# Altium project UAV_Main_Board.PrjPcb (part 1 of 2)
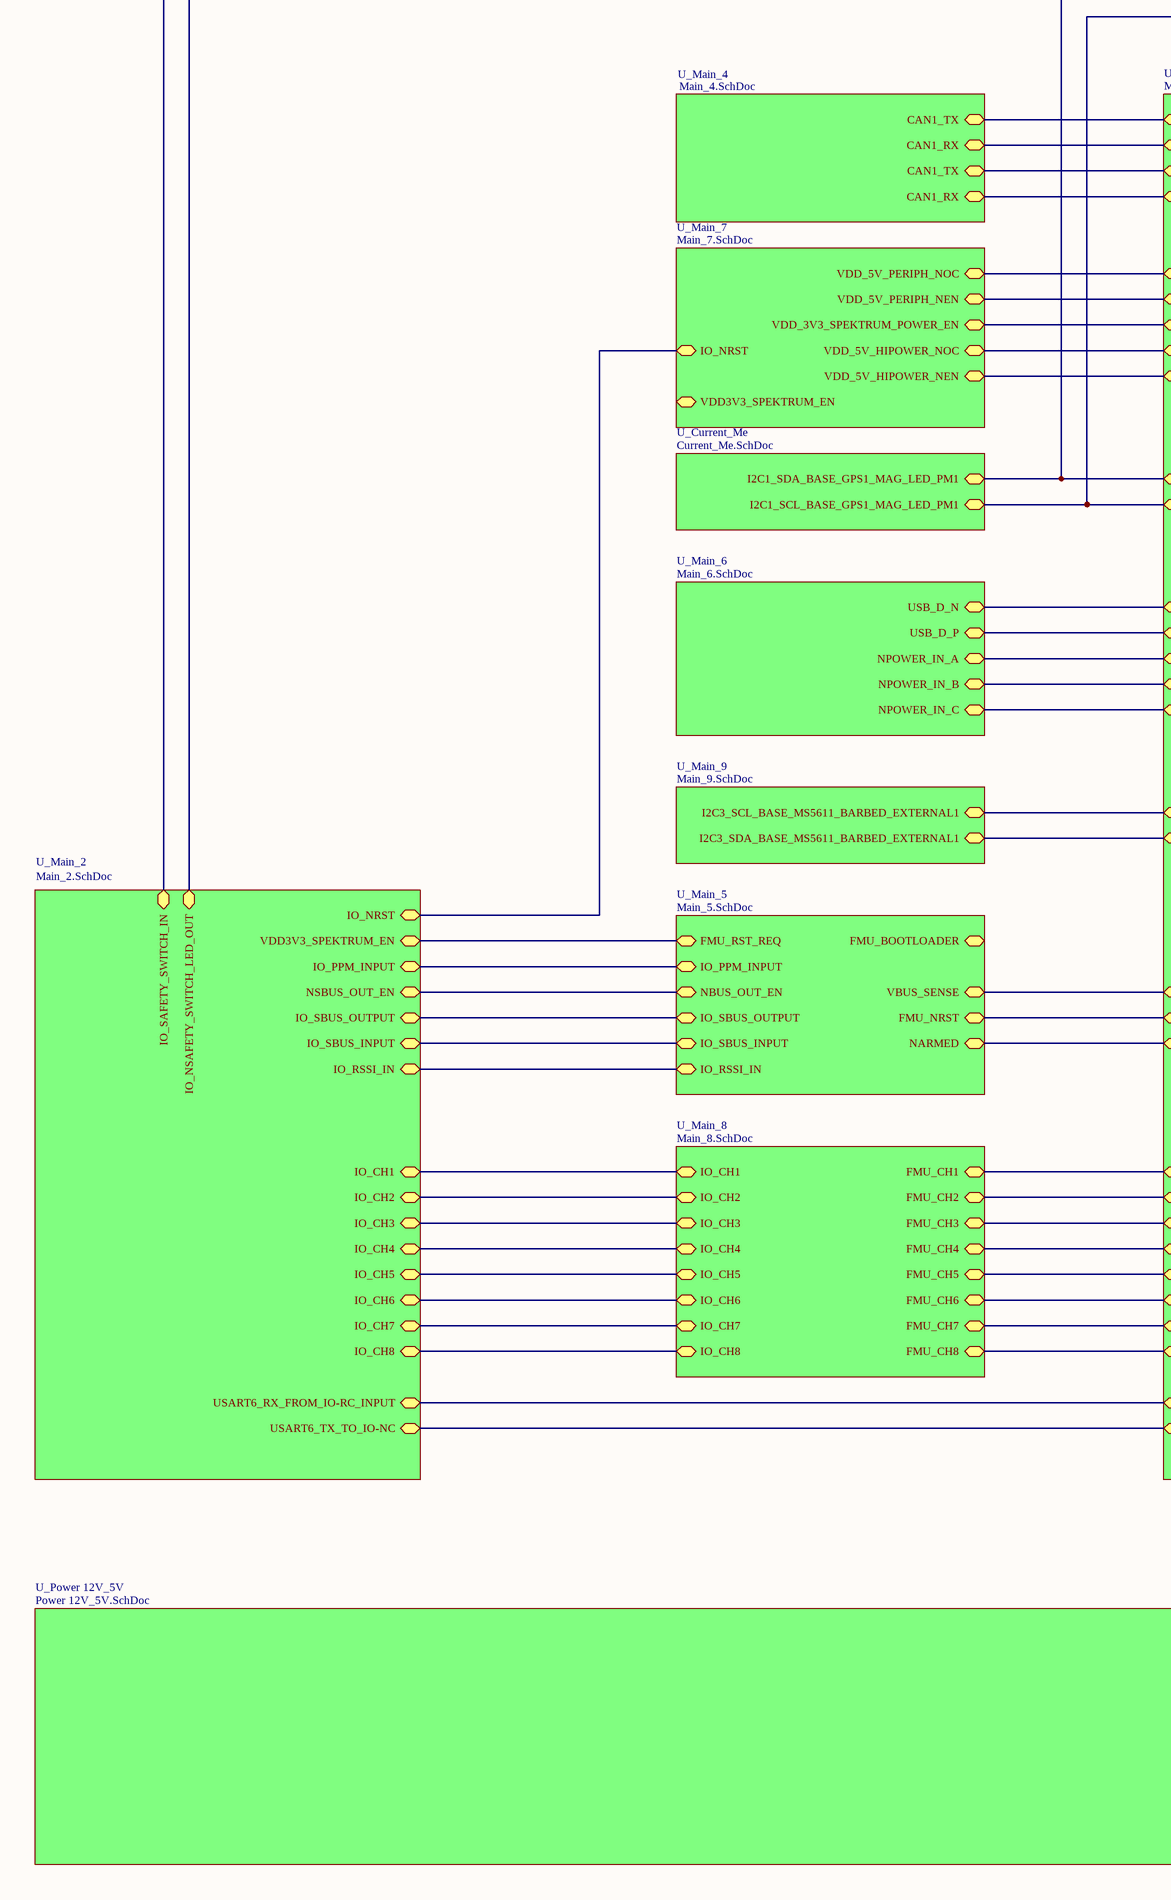
[diagram p0: UAV_Main.SchDoc, left]
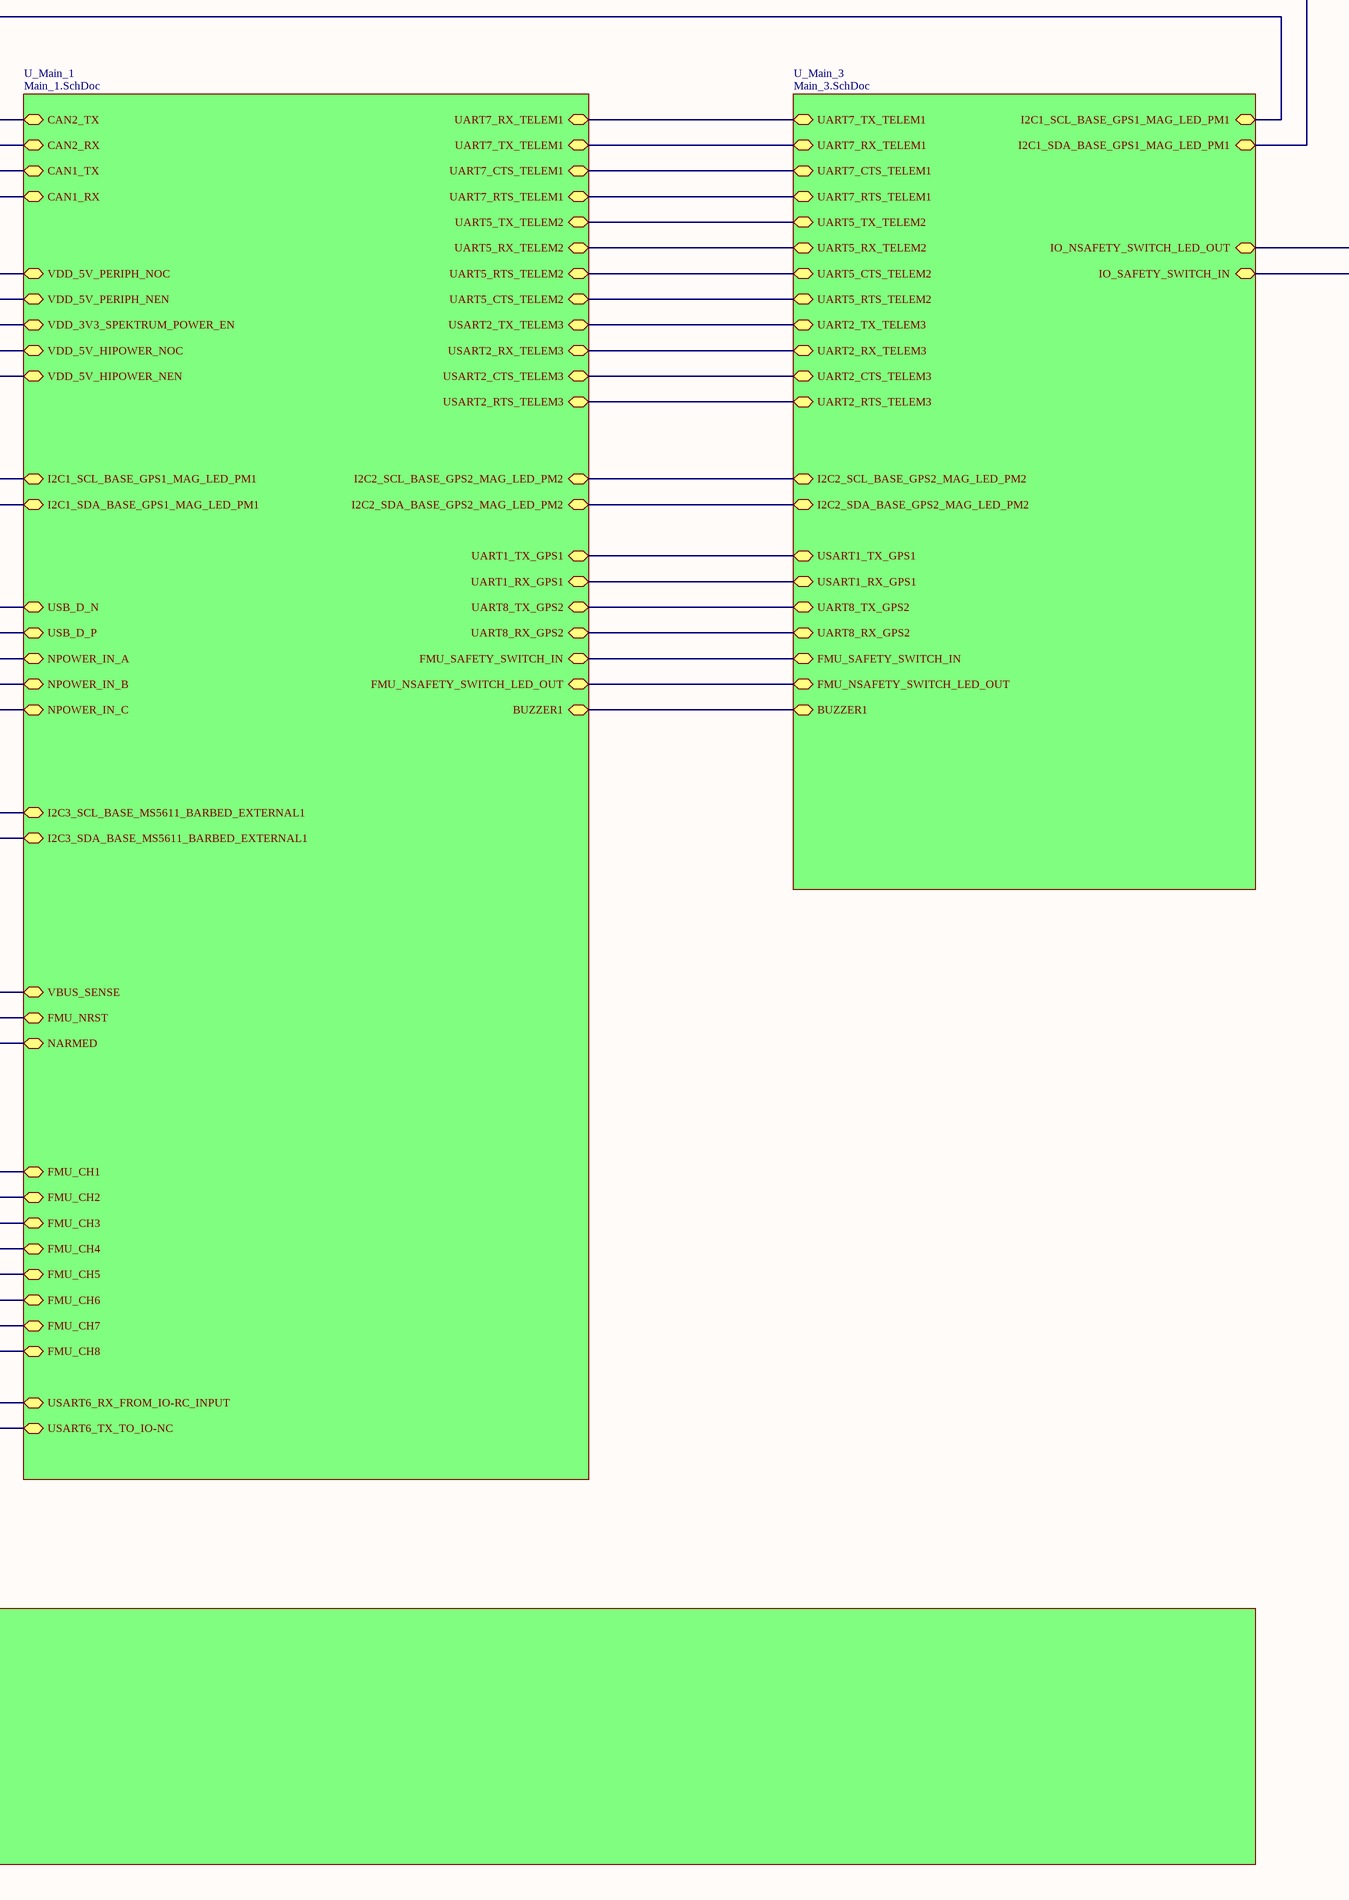
[diagram p1: UAV_Main.SchDoc, right]
12 sheets, 361 parts. Net scope: hierarchical (ports join the sheet entries above them; power ports are global).
Board file: UAV_mainboard.PcbDoc
Sheets:
  UAV_Main.SchDoc
    U_Power 12V_5V = Power 12V_5V.SchDoc
    U_Main_8 = Main_8.SchDoc
    U_Main_6 = Main_6.SchDoc
    U_Main_4 = Main_4.SchDoc
    U_Main_2 = Main_2.SchDoc
    U_Main_7 = Main_7.SchDoc
    U_Current_Me = Current_Me.SchDoc
    U_Main_1 = Main_1.SchDoc
    U_Main_9 = Main_9.SchDoc
    U_Main_3 = Main_3.SchDoc
    U_Main_5 = Main_5.SchDoc

## Sheet UAV_Main.SchDoc
size 599 x 500 mm; SheetNumber: 1; SheetTotal: 12

### Sub-sheets
U_Current_Me = Current_Me.SchDoc: I2C1_SCL_BASE_GPS1_MAG_LED_PM1 (bidir), I2C1_SDA_BASE_GPS1_MAG_LED_PM1 (bidir)
U_Main_1 = Main_1.SchDoc: FMU_CH5 (bidir), FMU_CH6 (bidir), FMU_CH7 (bidir), FMU_CH8 (bidir), FMU_CH1 (bidir), FMU_CH2 (bidir), FMU_CH3 (bidir), FMU_CH4 (bidir), CAN2_TX (bidir), CAN2_RX (bidir), FMU_NSAFETY_SWITCH_LED_OUT (bidir), VDD_3V3_SPEKTRUM_POWER_EN (bidir), VDD_5V_PERIPH_NEN (bidir), VDD_5V_PERIPH_NOC (bidir), CAN1_TX (bidir), CAN1_RX (bidir), VDD_5V_HIPOWER_NEN (bidir), VDD_5V_HIPOWER_NOC (bidir), NARMED (bidir), FMU_NRST (bidir), NPOWER_IN_A (bidir), NPOWER_IN_B (bidir), NPOWER_IN_C (bidir), USB_D_P (bidir), USB_D_N (bidir), VBUS_SENSE (bidir), USART6_RX_FROM_IO-RC_INPUT (bidir), USART6_TX_TO_IO-NC (bidir), UART7_TX_TELEM1 (bidir), UART7_RX_TELEM1 (bidir), UART5_TX_TELEM2 (bidir), UART5_RX_TELEM2 (bidir), UART5_RTS_TELEM2 (bidir), UART5_CTS_TELEM2 (bidir), USART2_TX_TELEM3 (bidir), USART2_RX_TELEM3 (bidir), USART2_RTS_TELEM3 (bidir), USART2_CTS_TELEM3 (bidir), UART1_RX_GPS1 (bidir), UART1_TX_GPS1 (bidir), UART8_TX_GPS2 (bidir), UART8_RX_GPS2 (bidir), UART7_RTS_TELEM1 (bidir), UART7_CTS_TELEM1 (bidir), I2C1_SCL_BASE_GPS1_MAG_LED_PM1 (bidir), I2C1_SDA_BASE_GPS1_MAG_LED_PM1 (bidir), I2C2_SCL_BASE_GPS2_MAG_LED_PM2 (bidir), I2C2_SDA_BASE_GPS2_MAG_LED_PM2 (bidir), I2C3_SCL_BASE_MS5611_BARBED_EXTERNAL1 (bidir), I2C3_SDA_BASE_MS5611_BARBED_EXTERNAL1 (bidir), BUZZER1 (bidir), FMU_SAFETY_SWITCH_IN (bidir)
U_Main_2 = Main_2.SchDoc: IO_NRST (bidir), VDD3V3_SPEKTRUM_EN (bidir), IO_NSAFETY_SWITCH_LED_OUT (bidir), IO_SBUS_INPUT (bidir), IO_SBUS_OUTPUT (bidir), IO_CH3 (bidir), IO_CH4 (bidir), IO_SAFETY_SWITCH_IN (bidir), NSBUS_OUT_EN (bidir), IO_CH7 (bidir), IO_CH8 (bidir), IO_CH1 (bidir), IO_CH2 (bidir), USART6_RX_FROM_IO-RC_INPUT (bidir), USART6_TX_TO_IO-NC (bidir), IO_RSSI_IN (bidir), IO_CH5 (bidir), IO_CH6 (bidir), IO_PPM_INPUT (bidir)
U_Main_3 = Main_3.SchDoc: UART7_TX_TELEM1 (bidir), UART7_RX_TELEM1 (bidir), UART7_CTS_TELEM1 (bidir), UART7_RTS_TELEM1 (bidir), UART5_TX_TELEM2 (bidir), UART5_RX_TELEM2 (bidir), UART5_CTS_TELEM2 (bidir), UART5_RTS_TELEM2 (bidir), UART2_TX_TELEM3 (bidir), UART2_RX_TELEM3 (bidir), UART2_CTS_TELEM3 (bidir), UART2_RTS_TELEM3 (bidir), USART1_TX_GPS1 (bidir), USART1_RX_GPS1 (bidir), I2C1_SCL_BASE_GPS1_MAG_LED_PM1 (bidir), I2C1_SDA_BASE_GPS1_MAG_LED_PM1 (bidir), IO_SAFETY_SWITCH_IN (bidir), FMU_SAFETY_SWITCH_IN (bidir), FMU_NSAFETY_SWITCH_LED_OUT (bidir), IO_NSAFETY_SWITCH_LED_OUT (bidir), BUZZER1 (bidir), UART8_TX_GPS2 (bidir), UART8_RX_GPS2 (bidir), I2C2_SCL_BASE_GPS2_MAG_LED_PM2 (bidir), I2C2_SDA_BASE_GPS2_MAG_LED_PM2 (bidir)
U_Main_4 = Main_4.SchDoc: CAN1_TX (bidir), CAN1_RX (bidir), CAN1_TX (bidir), CAN1_RX (bidir)
U_Main_5 = Main_5.SchDoc: FMU_BOOTLOADER (bidir), VBUS_SENSE (bidir), FMU_NRST (bidir), NARMED (bidir), FMU_RST_REQ (bidir), IO_PPM_INPUT (bidir), NBUS_OUT_EN (bidir), IO_SBUS_INPUT (bidir), IO_SBUS_OUTPUT (bidir), IO_RSSI_IN (bidir)
U_Main_6 = Main_6.SchDoc: USB_D_N (bidir), USB_D_P (bidir), NPOWER_IN_A (bidir), NPOWER_IN_B (bidir), NPOWER_IN_C (bidir)
U_Main_7 = Main_7.SchDoc: VDD3V3_SPEKTRUM_EN (bidir), VDD_3V3_SPEKTRUM_POWER_EN (bidir), VDD_5V_HIPOWER_NOC (bidir), VDD_5V_HIPOWER_NEN (bidir), IO_NRST (bidir), VDD_5V_PERIPH_NEN (bidir), VDD_5V_PERIPH_NOC (bidir)
U_Main_8 = Main_8.SchDoc: IO_CH5 (bidir), IO_CH6 (bidir), IO_CH7 (bidir), IO_CH8 (bidir), IO_CH1 (bidir), IO_CH2 (bidir), IO_CH3 (bidir), IO_CH4 (bidir), FMU_CH1 (bidir), FMU_CH2 (bidir), FMU_CH3 (bidir), FMU_CH4 (bidir), FMU_CH8 (bidir), FMU_CH7 (bidir), FMU_CH6 (bidir), FMU_CH5 (bidir)
U_Main_9 = Main_9.SchDoc: I2C3_SCL_BASE_MS5611_BARBED_EXTERNAL1 (bidir), I2C3_SDA_BASE_MS5611_BARBED_EXTERNAL1 (bidir)
U_Power 12V_5V = Power 12V_5V.SchDoc: no entries

### Nets
IO_RSSI_IN: sheet U_Main_2/IO_RSSI_IN, sheet U_Main_5/IO_RSSI_IN
NetC810_2: sheet U_Main_2/IO_NRST, sheet U_Main_7/IO_NRST
NetF400_1: sheet U_Main_1/BUZZER1, sheet U_Main_3/BUZZER1
NetIC601_4: sheet U_Main_1/VBUS_SENSE, sheet U_Main_5/VBUS_SENSE
NetIC602_1: sheet U_Main_1/NARMED, sheet U_Main_5/NARMED
NetIC602_2: sheet U_Main_2/VDD3V3_SPEKTRUM_EN, sheet U_Main_5/FMU_RST_REQ
NetIC602_4: sheet U_Main_1/FMU_NRST, sheet U_Main_5/FMU_NRST
NetIC603_5: sheet U_Main_2/IO_SBUS_OUTPUT, sheet U_Main_5/IO_SBUS_OUTPUT
NetIC603_6: sheet U_Main_2/IO_SBUS_INPUT, sheet U_Main_5/IO_SBUS_INPUT
NetIC700_7: sheet U_Main_6/NPOWER_IN_A, sheet U_Main_1/NPOWER_IN_A
NetIC700_8: sheet U_Main_6/NPOWER_IN_B, sheet U_Main_1/NPOWER_IN_B
NetIC700_9: sheet U_Main_6/NPOWER_IN_C, sheet U_Main_1/NPOWER_IN_C
NetIC1000_5: sheet U_Main_1/I2C3_SDA_BASE_MS5611_BARBED_EXTERNAL1, sheet U_Main_9/I2C3_SDA_BASE_MS5611_BARBED_EXTERNAL1
NetIC1000_6: sheet U_Main_1/I2C3_SCL_BASE_MS5611_BARBED_EXTERNAL1, sheet U_Main_9/I2C3_SCL_BASE_MS5611_BARBED_EXTERNAL1
NetR9_1: sheet U_Current_Me/I2C1_SCL_BASE_GPS1_MAG_LED_PM1, sheet U_Main_1/I2C1_SDA_BASE_GPS1_MAG_LED_PM1, sheet U_Main_3/I2C1_SCL_BASE_GPS1_MAG_LED_PM1
NetR10_1: sheet U_Current_Me/I2C1_SDA_BASE_GPS1_MAG_LED_PM1, sheet U_Main_1/I2C1_SCL_BASE_GPS1_MAG_LED_PM1, sheet U_Main_3/I2C1_SDA_BASE_GPS1_MAG_LED_PM1
NetR300_2: sheet U_Main_2/USART6_RX_FROM_IO-RC_INPUT, sheet U_Main_1/USART6_RX_FROM_IO-RC_INPUT
NetR301_2: sheet U_Main_2/USART6_TX_TO_IO-NC, sheet U_Main_1/USART6_TX_TO_IO-NC
NetR400_1: sheet U_Main_1/UART7_RX_TELEM1, sheet U_Main_3/UART7_TX_TELEM1
NetR401_1: sheet U_Main_1/UART7_TX_TELEM1, sheet U_Main_3/UART7_RX_TELEM1
NetR402_1: sheet U_Main_1/UART7_CTS_TELEM1, sheet U_Main_3/UART7_CTS_TELEM1
NetR403_1: sheet U_Main_1/UART7_RTS_TELEM1, sheet U_Main_3/UART7_RTS_TELEM1
NetR404_1: sheet U_Main_1/UART1_TX_GPS1, sheet U_Main_3/USART1_TX_GPS1
NetR405_1: sheet U_Main_1/UART1_RX_GPS1, sheet U_Main_3/USART1_RX_GPS1
NetR408_1: sheet U_Main_1/UART5_TX_TELEM2, sheet U_Main_3/UART5_TX_TELEM2
NetR409_1: sheet U_Main_2/IO_SAFETY_SWITCH_IN, sheet U_Main_3/IO_SAFETY_SWITCH_IN
NetR410_1: sheet U_Main_1/UART5_RX_TELEM2, sheet U_Main_3/UART5_RX_TELEM2
NetR411_1: sheet U_Main_1/FMU_SAFETY_SWITCH_IN, sheet U_Main_3/FMU_SAFETY_SWITCH_IN
NetR412_1: sheet U_Main_1/FMU_NSAFETY_SWITCH_LED_OUT, sheet U_Main_3/FMU_NSAFETY_SWITCH_LED_OUT
NetR413_1: sheet U_Main_1/UART5_RTS_TELEM2, sheet U_Main_3/UART5_CTS_TELEM2
NetR414_1: sheet U_Main_2/IO_NSAFETY_SWITCH_LED_OUT, sheet U_Main_3/IO_NSAFETY_SWITCH_LED_OUT
NetR415_1: sheet U_Main_1/UART5_CTS_TELEM2, sheet U_Main_3/UART5_RTS_TELEM2
NetR418_1: sheet U_Main_1/USART2_TX_TELEM3, sheet U_Main_3/UART2_TX_TELEM3
NetR419_1: sheet U_Main_1/USART2_RX_TELEM3, sheet U_Main_3/UART2_RX_TELEM3
NetR420_1: sheet U_Main_1/USART2_CTS_TELEM3, sheet U_Main_3/UART2_CTS_TELEM3
NetR421_1: sheet U_Main_1/USART2_RTS_TELEM3, sheet U_Main_3/UART2_RTS_TELEM3
NetR422_1: sheet U_Main_1/UART8_TX_GPS2, sheet U_Main_3/UART8_TX_GPS2
NetR423_1: sheet U_Main_1/UART8_RX_GPS2, sheet U_Main_3/UART8_RX_GPS2
NetR424_1: sheet U_Main_1/I2C2_SCL_BASE_GPS2_MAG_LED_PM2, sheet U_Main_3/I2C2_SCL_BASE_GPS2_MAG_LED_PM2
NetR425_1: sheet U_Main_1/I2C2_SDA_BASE_GPS2_MAG_LED_PM2, sheet U_Main_3/I2C2_SDA_BASE_GPS2_MAG_LED_PM2
NetR604_1: sheet U_Main_2/IO_PPM_INPUT, sheet U_Main_5/IO_PPM_INPUT
NetR608_2: sheet U_Main_2/NSBUS_OUT_EN, sheet U_Main_5/NBUS_OUT_EN
NetR701_2: sheet U_Main_6/USB_D_N, sheet U_Main_1/USB_D_N
NetR702_2: sheet U_Main_6/USB_D_P, sheet U_Main_1/USB_D_P
NetR802_2: sheet U_Main_7/VDD_5V_HIPOWER_NOC, sheet U_Main_1/VDD_5V_HIPOWER_NOC
NetR803_1: sheet U_Main_7/VDD_3V3_SPEKTRUM_POWER_EN, sheet U_Main_1/VDD_3V3_SPEKTRUM_POWER_EN
NetR804_2: sheet U_Main_7/VDD_5V_HIPOWER_NEN, sheet U_Main_1/VDD_5V_HIPOWER_NEN
NetR808_2: sheet U_Main_7/VDD_5V_PERIPH_NOC, sheet U_Main_1/VDD_5V_PERIPH_NOC
NetR809_2: sheet U_Main_7/VDD_5V_PERIPH_NEN, sheet U_Main_1/VDD_5V_PERIPH_NEN
NetR900_1: sheet U_Main_8/FMU_CH8, sheet U_Main_1/FMU_CH8
NetR901_1: sheet U_Main_8/FMU_CH7, sheet U_Main_1/FMU_CH7
NetR902_1: sheet U_Main_8/FMU_CH6, sheet U_Main_1/FMU_CH6
NetR903_1: sheet U_Main_8/FMU_CH5, sheet U_Main_1/FMU_CH5
NetR904_1: sheet U_Main_8/FMU_CH4, sheet U_Main_1/FMU_CH4
NetR905_1: sheet U_Main_8/FMU_CH3, sheet U_Main_1/FMU_CH3
NetR906_1: sheet U_Main_8/FMU_CH2, sheet U_Main_1/FMU_CH2
NetR907_1: sheet U_Main_8/FMU_CH1, sheet U_Main_1/FMU_CH1
NetR908_1: sheet U_Main_8/IO_CH4, sheet U_Main_2/IO_CH4
NetR909_1: sheet U_Main_8/IO_CH3, sheet U_Main_2/IO_CH3
NetR910_1: sheet U_Main_8/IO_CH2, sheet U_Main_2/IO_CH2
NetR911_1: sheet U_Main_8/IO_CH1, sheet U_Main_2/IO_CH1
NetR912_1: sheet U_Main_8/IO_CH8, sheet U_Main_2/IO_CH8
NetR913_1: sheet U_Main_8/IO_CH7, sheet U_Main_2/IO_CH7
NetR914_1: sheet U_Main_8/IO_CH6, sheet U_Main_2/IO_CH6
NetR915_1: sheet U_Main_8/IO_CH5, sheet U_Main_2/IO_CH5
NetU500_1: sheet U_Main_4/CAN1_TX, sheet U_Main_4/CAN1_TX, sheet U_Main_1/CAN2_TX, sheet U_Main_1/CAN1_TX
NetU500_4: sheet U_Main_4/CAN1_RX, sheet U_Main_4/CAN1_RX, sheet U_Main_1/CAN2_RX, sheet U_Main_1/CAN1_RX

## Sheet Power 12V_5V.SchDoc
size 250 x 320 mm; SheetNumber: 3; SheetTotal: 12
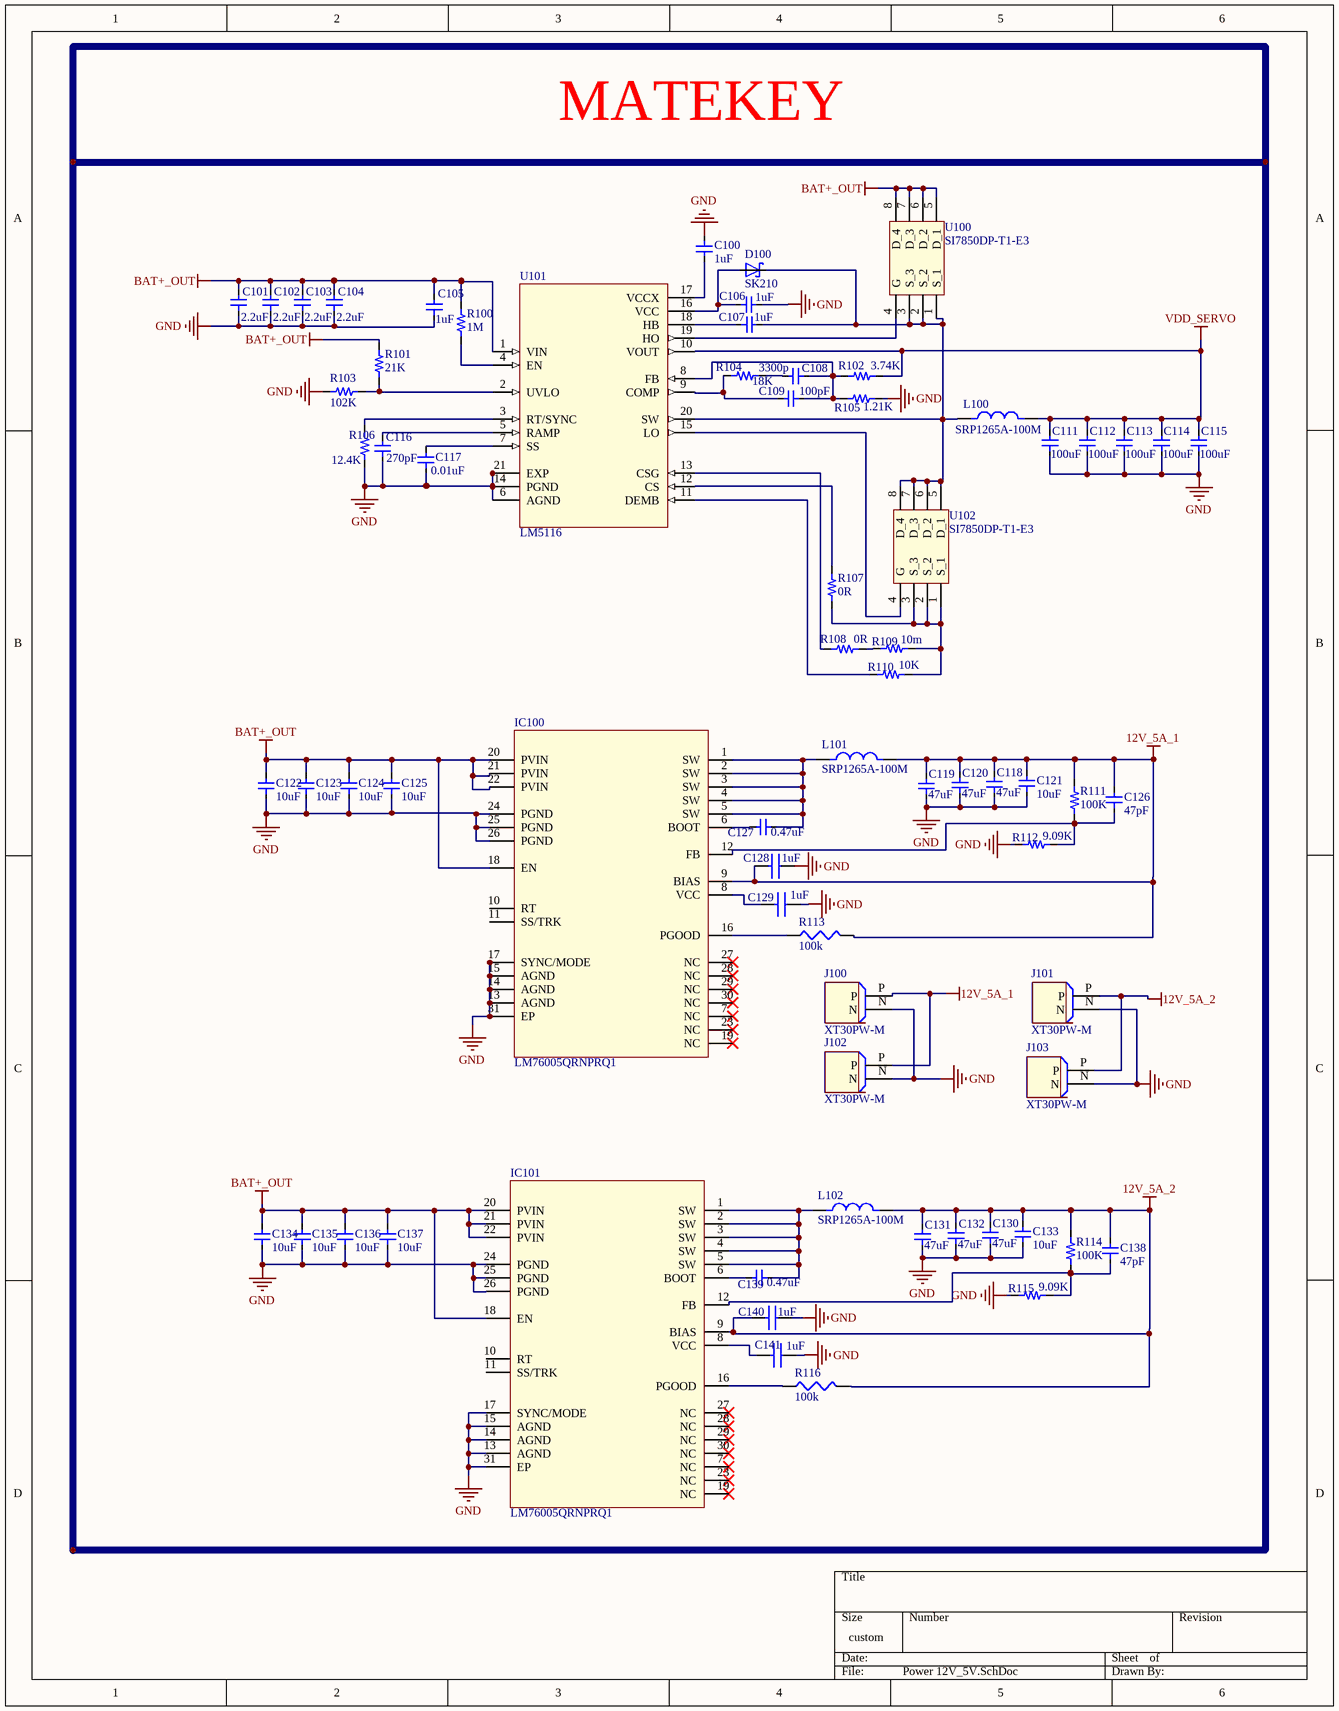
[diagram p2: Power 12V_5V.SchDoc]

### Parts
C100  1uF  [C0603]
C101  2.2uF  [C1812]
C102  2.2uF  [C1812]
C103  2.2uF  [C1812]
C104  2.2uF  [C1812]
C105  1uF  [C1210]
C106  1uF  [C0603]
C107  1uF  [C0603]
C108  3300p  [C0603]
C109  100pF  [C0603]
C111  100uF  [C1812]
C112  100uF  [C1812]
C113  100uF  [C1812]
C114  100uF  [C1812]
C115  100uF  [C1812]
C116  270pF  [C0603]
C117  0.01uF  [C0603]
C118  47uF  [C1210]
C119  47uF  [C1210]
C120  47uF  [C1210]
C121  10uF  [C0603]
C122  10uF  [C1206]
C123  10uF  [C1206]
C124  10uF  [C1206]
C125  10uF  [C1206]
C126  47pF  [C0603]
C127  0.47uF  [C0603]
C128  1uF  [C0402]
C129  1uF  [C0402]
C130  47uF  [C1210]
C131  47uF  [C1210]
C132  47uF  [C1210]
C133  10uF  [C0603]
C134  10uF  [C1206]
C135  10uF  [C1206]
C136  10uF  [C1206]
C137  10uF  [C1206]
C138  47pF  [C0603]
C139  0.47uF  [C0603]
C140  1uF  [C0402]
C141  1uF  [C0402]
D100  SK210  [SK210]
IC100  LM76005QRNPRQ1  [30-WFQFN Exposed Pad]
IC101  LM76005QRNPRQ1  [30-WFQFN Exposed Pad]
J100  XT30PW-M  [XT30PW-M]
J101  XT30PW-M  [XT30PW-M]
J102  XT30PW-M  [XT30PW-M]
J103  XT30PW-M  [XT30PW-M]
L100  SRP1265A-100M  [SRP1265A-100M]
L101  SRP1265A-100M  [SRP1265A-100M]
L102  SRP1265A-100M  [SRP1265A-100M]
R100  1M  [R0603]
R101  21K  [R0603]
R102  3.74K  [R0603]
R103  102K  [R0603]
R104  18K  [R0603]
R105  1.21K  [R0603]
R106  12.4K  [R0603]
R107  0R  [R0603]
R108  0R  [R0603]
R109  10m  [R2010]
R110  10K  [R0402]
R111  100K  [R0603]
R112  9.09K  [R0603]
R113  100k  [R0402]
R114  100K  [R0603]
R115  9.09K  [R0603]
R116  100k  [R0402]
U100  SI7850DP-T1-E3  [SO-8 Single]
U101  LM5116  [HTSSOP-20]
U102  SI7850DP-T1-E3  [SO-8 Single]

### Nets
12V_5A_1: C118.2 C119.2 C120.2 C121.2 C126.2 C128.2 IC100.9(BIAS) J100.P J102.P L101.2 R111.2 R113.2
12V_5A_2: C130.2 C131.2 C132.2 C133.2 C138.2 C140.2 IC101.9(BIAS) J101.P J103.P L102.2 R114.2 R116.2
BAT+_OUT: C101.2 C102.2 C103.2 C104.2 C105.2 C122.2 C123.2 C124.2 C125.2 C134.2 C135.2 C136.2 C137.2 IC100.18(EN) IC100.20(PVIN) IC100.21(PVIN) IC100.22(PVIN) IC101.18(EN) IC101.20(PVIN) IC101.21(PVIN) IC101.22(PVIN) R100.2 R101.1 U100.5(D_1) U100.6(D_2) U100.7(D_3) U100.8(D_4) U101.1(VIN)
GND: C100.1 C101.1 C102.1 C103.1 C104.1 C105.1 C106.2 C111.1 C112.1 C113.1 C114.1 C115.1 C116.1 C117.1 C118.1 C119.1 C120.1 C121.1 C122.1 C123.1 C124.1 C125.1 C128.1 C129.1 C130.1 C131.1 C132.1 C133.1 C134.1 C135.1 C136.1 C137.1 C140.1 C141.1 IC100.13(AGND) IC100.14(AGND) IC100.15(AGND) IC100.17(SYNC/MODE) IC100.24(PGND) IC100.25(PGND) IC100.26(PGND) IC100.31(EP) IC101.13(AGND) IC101.14(AGND) IC101.15(AGND) IC101.17(SYNC/MODE) IC101.24(PGND) IC101.25(PGND) IC101.26(PGND) IC101.31(EP) J100.N J101.N J102.N J103.N R103.2 R105.1 R106.1 R112.1 R115.1 U101.14(PGND) U101.21(EXP)
VDD_SERVO: C111.2 C112.2 C113.2 C114.2 C115.2 L100.2 R102.2 U101.10(VOUT)
NetC100_2: C100.2 U101.17(VCCX)
NetC106_1: C106.1 D100.A U101.16(VCC)
NetC107_1: C107.1 U101.18(HB)
NetC107_2: C107.2 D100.K L100.1 U100.1(S_1) U100.2(S_2) U100.3(S_3) U101.20(SW) U102.5(D_1) U102.6(D_2) U102.7(D_3) U102.8(D_4)
NetC108_1: C108.1 C109.1 R102.1 R105.2 U101.8(FB)
NetC108_2: C108.2 R104.1
NetC109_2: C109.2 R104.2 U101.9(COMP)
NetC116_2: C116.2 U101.5(RAMP)
NetC117_2: C117.2 U101.7(SS)
NetC126_1: C126.1 IC100.12(FB) R111.1 R112.2
NetC127_1: C127.1 IC100.1(SW) IC100.2(SW) IC100.3(SW) IC100.4(SW) IC100.5(SW) L101.1
NetC127_2: C127.2 IC100.6(BOOT)
NetC129_2: C129.2 IC100.8(VCC)
NetC138_1: C138.1 IC101.12(FB) R114.1 R115.2
NetC139_1: C139.1 IC101.1(SW) IC101.2(SW) IC101.3(SW) IC101.4(SW) IC101.5(SW) L102.1
NetC139_2: C139.2 IC101.6(BOOT)
NetC141_2: C141.2 IC101.8(VCC)
NetIC100_16: IC100.16(PGOOD) R113.1
NetIC101_16: IC101.16(PGOOD) R116.1
NetR100_1: R100.1 U101.4(EN)
NetR101_2: R101.2 R103.1 U101.2(UVLO)
NetR106_2: R106.2 U101.3(RT/SYNC)
NetR107_1: R107.1 R109.1 R110.2 U102.1(S_1) U102.2(S_2) U102.3(S_3)
NetR107_2: R107.2 U101.12(CS)
NetR108_1: R108.1 U101.13(CSG)
NetR108_2: R108.2 R109.2
NetR110_1: R110.1 U101.11(DEMB)
NetU100_4: U100.4(G) U101.19(HO)
NetU101_15: U101.15(LO) U102.4(G)

Not connected (* = marked no-connect by the designer): IC100 7(NC)* 10(RT) 11(SS/TRK) 19(NC)* 23(NC)* 27(NC)* 28(NC)* 29(NC)* 30(NC)*; IC101 7(NC)* 10(RT) 11(SS/TRK) 19(NC)* 23(NC)* 27(NC)* 28(NC)* 29(NC)* 30(NC)*; U101 6(AGND)

### Notes on the sheet
- MATEKEY

### Library data of the parts
C100 C106 C107 = CC0603KRX5R8BB105: 1 µF ±10% 25V Ceramic Capacitor X5R 0603 (1608 Metric)
C101-C104 = C4532X7R2A225M230KA: 2.2 µF ±20% 100V Ceramic Capacitor X7R 1812 (4532 Metric)
C105 = C3225X7R2A105M200AA: 1 µF ±20% 100V Ceramic Capacitor X7R 1210 (3225 Metric)
C108 = VJ0603Y332KXXAC: 3300 pF ±10% 25V Ceramic Capacitor X7R 0603 (1608 Metric)
C109 = CC0603KRX7R8BB101: 100 pF ±10% 25V Ceramic Capacitor X7R 0603 (1608 Metric)
C111-C115 = C4532X6S0J107M280KC: CAP CER 100UF 6.3V X6S 1812
C116 = CC0603JRNPO9BN271: 270 pF ±5% 50V Ceramic Capacitor C0G, NP0 0603 (1608 Metric)
C117 = C0603C103J5REC7411: 10000 pF ±5% 50V Ceramic Capacitor X7R 0603 (1608 Metric)
C118-C120 C130-C132 = TMK325ABJ476MM-T: 47 µF ±20% 25V Ceramic Capacitor X5R 1210 (3225 Metric)
C121 C133 = CC0603KRX5R6BB106: 10 µF ±10% 10V Ceramic Capacitor X5R 0603 (1608 Metric)
C122-C125 C134-C137 = C3216X6S2A106K160AC: 10 µF ±10% 100V Ceramic Capacitor X6S 1206 (3216 Metric)
C126 C138 = CC0603JRNPO8BN470: 47 pF ±5% 25V Ceramic Capacitor C0G, NP0 0603 (1608 Metric)
C127 C139 = CC0603KRX5R9BB474: 0.47 µF ±10% 50V Ceramic Capacitor X5R 0603 (1608 Metric)
C128 C129 C140 C141 = EMK105BJ105MV-F: CAP CER 1UF 16V X5R 0402; Supplier 1: Digikey; Supplier Part Number 1: 587-5514-1-ND
D100 = SK210: Diode 100 V 2A Surface Mount DO-214AA (SMB)
IC100 IC101 = LM76005QRNPRQ1: Buck Switching Regulator IC Positive Adjustable 1V 1 Output 5A 30-WFQFN Exposed Pad
J100-J103 = XT30PW-M: Socket; DC supply; XT30; male; PIN: 2; on PCBs; THT; Colour: yellow
L100-L102 = SRP1265A-100M: FIXED IND 10UH 10A 16.5 MOHM SMD
R100 = RT0603BRD071ML: 1 MOhms ±0.1% 0.1W, 1/10W Chip Resistor 0603 (1608 Metric) Thin Film
R101 = RC0603FR-0721KL: 21 kOhms ±1% 0.1W, 1/10W Chip Resistor 0603 (1608 Metric) Moisture Resistant Thick Film
R102 = RC0603FR-073K74L: 3.74 kOhms ±1% 0.1W, 1/10W Chip Resistor 0603 (1608 Metric) Moisture Resistant Thick Film
R103 = RT0603BRD07102KL: 102 kOhms ±0.1% 0.1W, 1/10W Chip Resistor 0603 (1608 Metric) Thin Film
R104 = RC0603FR-0718KL: 18 kOhms ±1% 0.1W, 1/10W Chip Resistor 0603 (1608 Metric) Moisture Resistant Thick Film
R105 = RC0603FR-071K21L: 1.21 kOhms ±1% 0.1W, 1/10W Chip Resistor 0603 (1608 Metric) Moisture Resistant Thick Film
R106 = RC0603FR-0712K4L: 12.4 kOhms ±1% 0.1W, 1/10W Chip Resistor 0603 (1608 Metric) Moisture Resistant Thick Film
R107 R108 = CR0603AJ/-000EAS: 0 Ohms Jumper Chip Resistor 0603 (1608 Metric) Anti-Sulfur, Automotive AEC-Q200, Moisture Resistant Thick Film
R109 = TLR2H15DR010FTDG: 10 mOhms ±1% 1.5W Chip Resistor 2010 (5025 Metric) Current Sense Metal Foil
R110 = RC1005F103CS: RES SMD 10K OHM 1% 1/16W 0402
R111 R114 = RC0603FR-07100KL: 100 kOhms ±1% 0.1W, 1/10W Chip Resistor 0603 (1608 Metric) Moisture Resistant Thick Film
R112 R115 = RMCF0603FT9K09: 9.09 kOhms ±1% 0.1W, 1/10W Chip Resistor 0603 (1608 Metric) Automotive AEC-Q200 Thick Film
R113 R116 = AC0402JR-07100KL: RES SMD 100K OHM 5% 1/16W 0402; Supplier 1: Future Electronics; Supplier Part Number 1: 3031172
U100 U102 = SI7850DP-T1-E3: MOSFETs 60V Vds 20V Vgs PowerPAK SO-8
U101 = LM5116MHX/NOPB: 6-100V Wide Vin, Current Mode Synchronous Buck Controller

## Sheet Main_8.SchDoc
size 199 x 260 mm; SheetNumber: 11; SheetTotal: 12
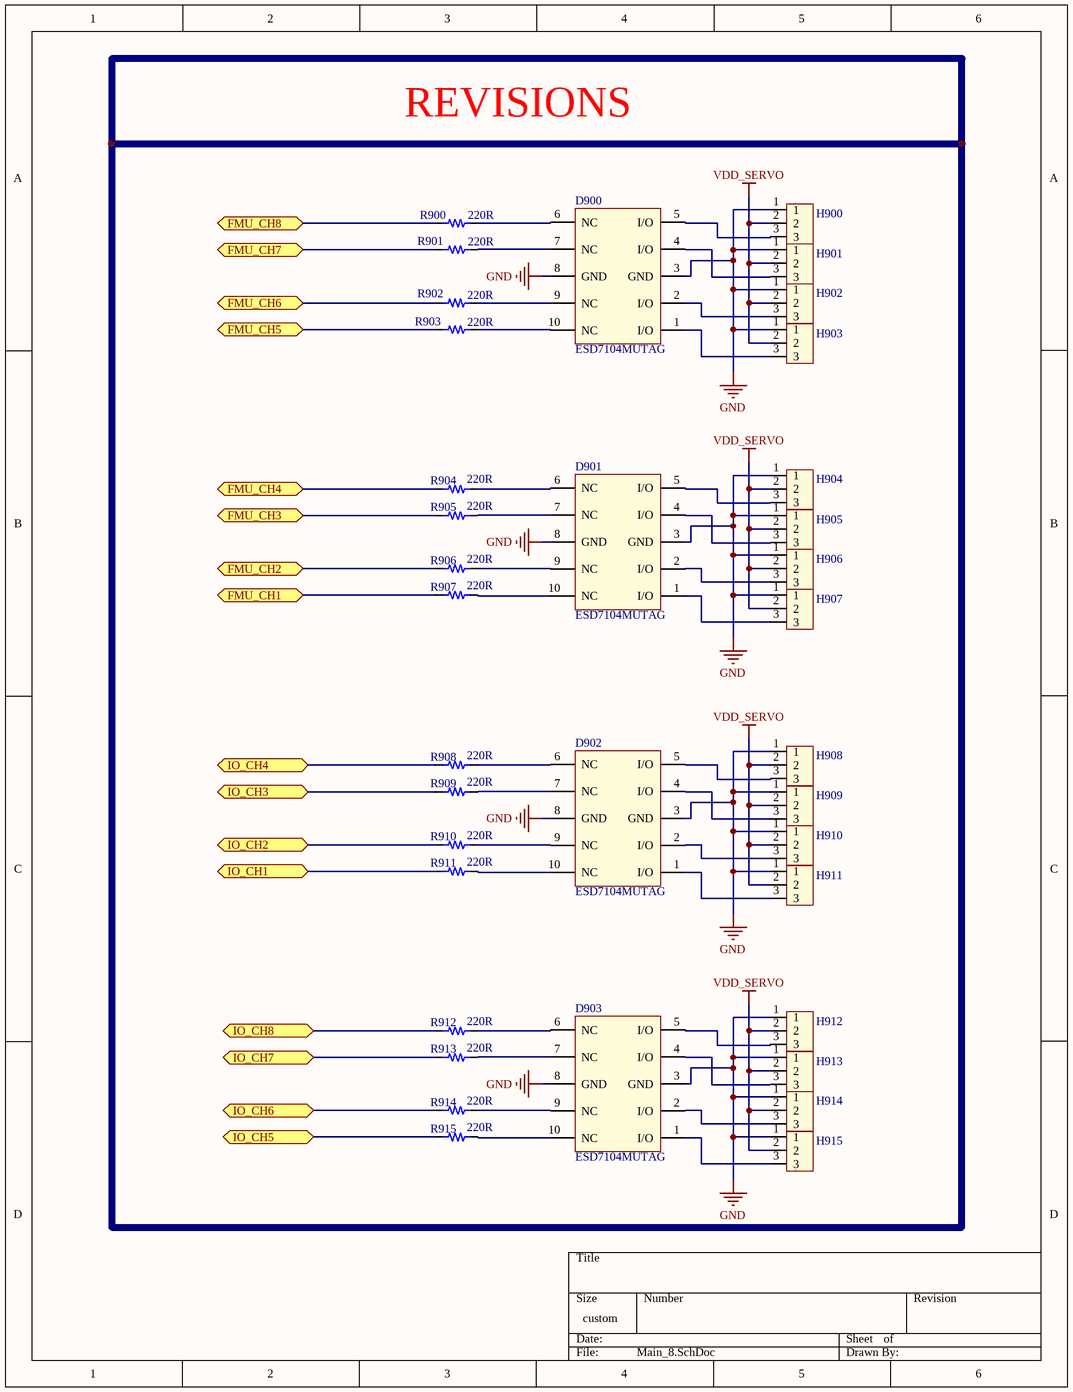
[diagram p3: Main_8.SchDoc]

### Parts
D900  ESD7104MUTAG  [UDFN10 2.5x1, 0.5P]
D901  ESD7104MUTAG  [UDFN10 2.5x1, 0.5P]
D902  ESD7104MUTAG  [UDFN10 2.5x1, 0.5P]
D903  ESD7104MUTAG  [UDFN10 2.5x1, 0.5P]
H900  Header 3x1  [Header 3x1]  (value not drawn)
H901  Header 3x1  [Header 3x1]  (value not drawn)
H902  Header 3x1  [Header 3x1]  (value not drawn)
H903  Header 3x1  [Header 3x1]  (value not drawn)
H904  Header 3x1  [Header 3x1]  (value not drawn)
H905  Header 3x1  [Header 3x1]  (value not drawn)
H906  Header 3x1  [Header 3x1]  (value not drawn)
H907  Header 3x1  [Header 3x1]  (value not drawn)
H908  Header 3x1  [Header 3x1]  (value not drawn)
H909  Header 3x1  [Header 3x1]  (value not drawn)
H910  Header 3x1  [Header 3x1]  (value not drawn)
H911  Header 3x1  [Header 3x1]  (value not drawn)
H912  Header 3x1  [Header 3x1]  (value not drawn)
H913  Header 3x1  [Header 3x1]  (value not drawn)
H914  Header 3x1  [Header 3x1]  (value not drawn)
H915  Header 3x1  [Header 3x1]  (value not drawn)
R900  220R  [R0402]
R901  220R  [R0402]
R902  220R  [R0402]
R903  220R  [R0402]
R904  220R  [R0402]
R905  220R  [R0402]
R906  220R  [R0402]
R907  220R  [R0402]
R908  220R  [R0402]
R909  220R  [R0402]
R910  220R  [R0402]
R911  220R  [R0402]
R912  220R  [R0402]
R913  220R  [R0402]
R914  220R  [R0402]
R915  220R  [R0402]

### Ports
FMU_CH1 (bidir), FMU_CH2 (bidir), FMU_CH3 (bidir), FMU_CH4 (bidir), FMU_CH5 (bidir), FMU_CH6 (bidir), FMU_CH7 (bidir), FMU_CH8 (bidir), IO_CH1 (bidir), IO_CH2 (bidir), IO_CH3 (bidir), IO_CH4 (bidir), IO_CH5 (bidir), IO_CH6 (bidir), IO_CH7 (bidir), IO_CH8 (bidir)

### Nets
GND: D900.3(GND) D900.8(GND) D901.3(GND) D901.8(GND) D902.3(GND) D902.8(GND) D903.3(GND) D903.8(GND) H900.1 H901.1 H902.1 H903.1 H904.1 H905.1 H906.1 H907.1 H908.1 H909.1 H910.1 H911.1 H912.1 H913.1 H914.1 H915.1
VDD_SERVO: H900.2 H901.2 H902.2 H903.2 H904.2 H905.2 H906.2 H907.2 H908.2 H909.2 H910.2 H911.2 H912.2 H913.2 H914.2 H915.2
NetD900_1: D900.1(I/O) H903.3
NetD900_2: D900.2(I/O) H902.3
NetD900_4: D900.4(I/O) H901.3
NetD900_5: D900.5(I/O) H900.3
NetD900_6: D900.6(NC) R900.2
NetD900_7: D900.7(NC) R901.2
NetD900_9: D900.9(NC) R902.2
NetD900_10: D900.10(NC) R903.2
NetD901_1: D901.1(I/O) H907.3
NetD901_2: D901.2(I/O) H906.3
NetD901_4: D901.4(I/O) H905.3
NetD901_5: D901.5(I/O) H904.3
NetD901_6: D901.6(NC) R904.2
NetD901_7: D901.7(NC) R905.2
NetD901_9: D901.9(NC) R906.2
NetD901_10: D901.10(NC) R907.2
NetD902_1: D902.1(I/O) H911.3
NetD902_2: D902.2(I/O) H910.3
NetD902_4: D902.4(I/O) H909.3
NetD902_5: D902.5(I/O) H908.3
NetD902_6: D902.6(NC) R908.2
NetD902_7: D902.7(NC) R909.2
NetD902_9: D902.9(NC) R910.2
NetD902_10: D902.10(NC) R911.2
NetD903_1: D903.1(I/O) H915.3
NetD903_2: D903.2(I/O) H914.3
NetD903_4: D903.4(I/O) H913.3
NetD903_5: D903.5(I/O) H912.3
NetD903_6: D903.6(NC) R912.2
NetD903_7: D903.7(NC) R913.2
NetD903_9: D903.9(NC) R914.2
NetD903_10: D903.10(NC) R915.2
NetR900_1: R900.1 ; port FMU_CH8
NetR901_1: R901.1 ; port FMU_CH7
NetR902_1: R902.1 ; port FMU_CH6
NetR903_1: R903.1 ; port FMU_CH5
NetR904_1: R904.1 ; port FMU_CH4
NetR905_1: R905.1 ; port FMU_CH3
NetR906_1: R906.1 ; port FMU_CH2
NetR907_1: R907.1 ; port FMU_CH1
NetR908_1: R908.1 ; port IO_CH4
NetR909_1: R909.1 ; port IO_CH3
NetR910_1: R910.1 ; port IO_CH2
NetR911_1: R911.1 ; port IO_CH1
NetR912_1: R912.1 ; port IO_CH8
NetR913_1: R913.1 ; port IO_CH7
NetR914_1: R914.1 ; port IO_CH6
NetR915_1: R915.1 ; port IO_CH5

### Notes on the sheet
- REVISIONS

### Library data of the parts
D900-D903 = ESD7104MUTAG: TVS DIODE 5VWM 10VC 10UDFN
R900-R915 = RC0402FR-07220RL: RES 220 OHM 1% 1/16W 0402

## Sheet Main_6.SchDoc
size 330 x 199 mm; SheetNumber: 9; SheetTotal: 12
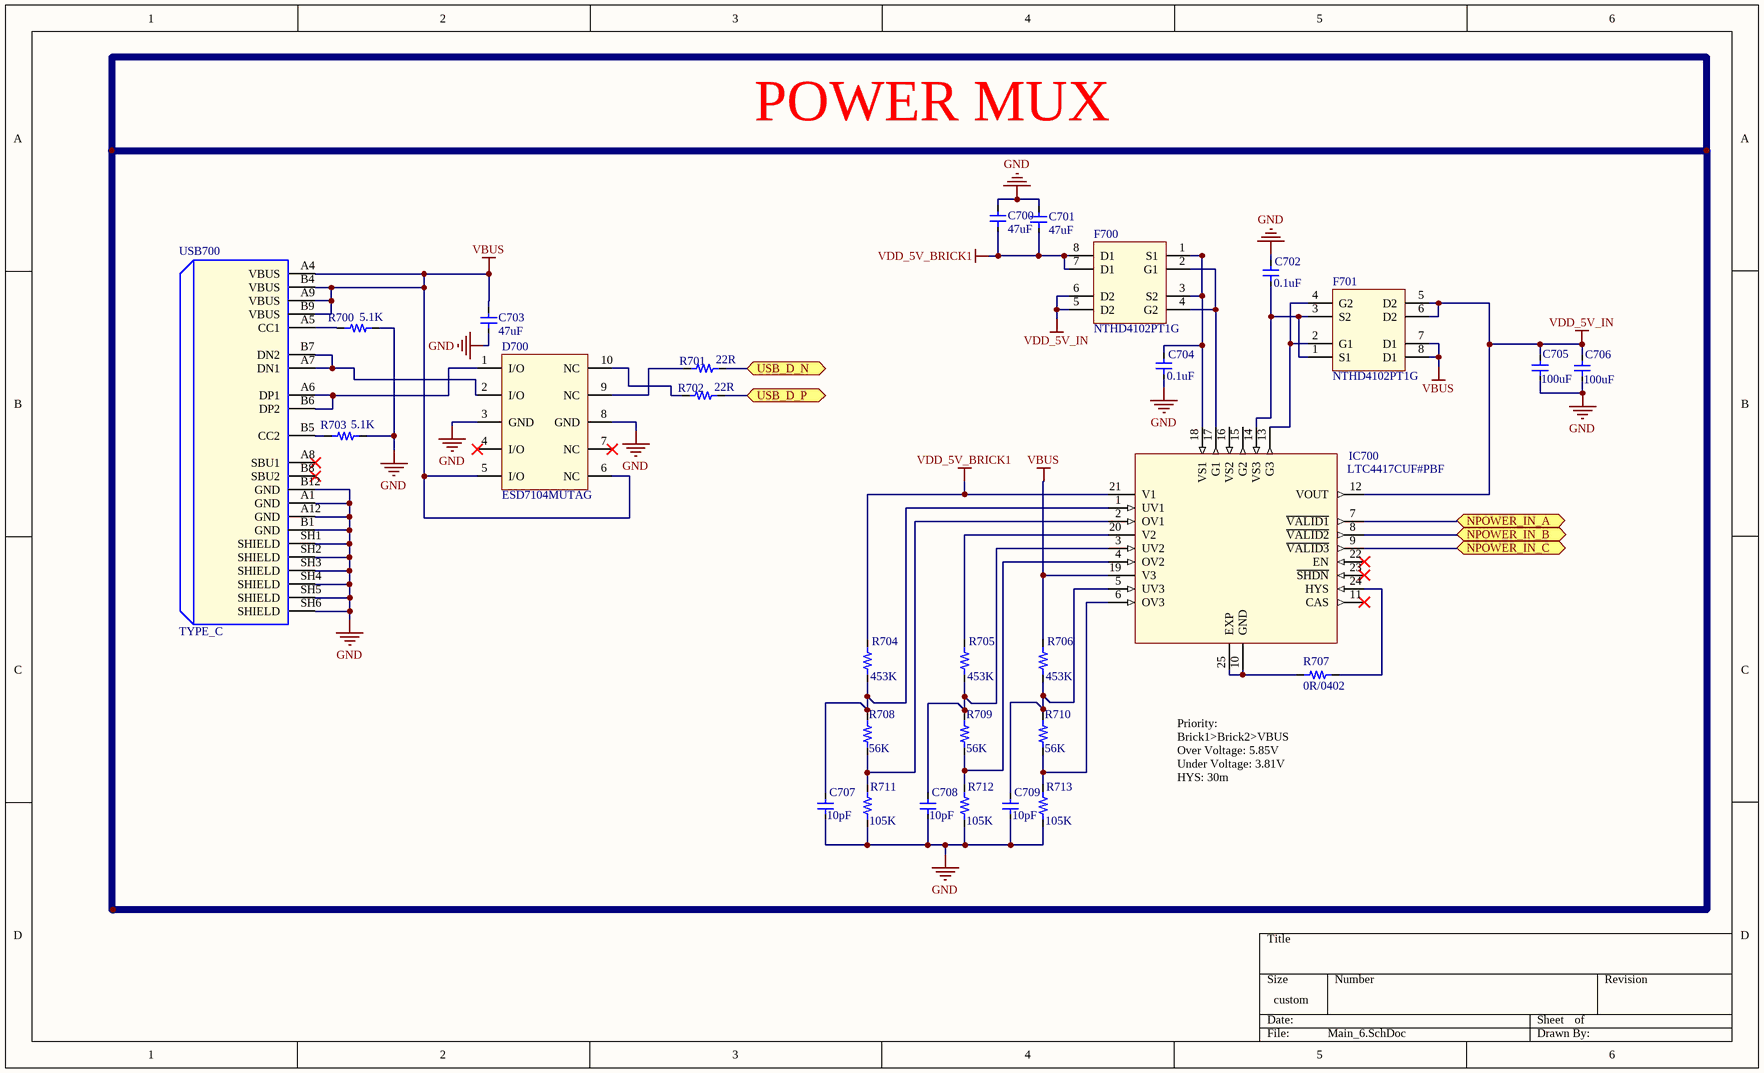
[diagram p4: Main_6.SchDoc]

### Parts
C700  47uF  [C0805]
C701  47uF  [C0805]
C702  0.1uF  [C0603]
C703  47uF  [C0805]
C704  0.1uF  [C0603]
C705  100uF  [C1206]
C706  100uF  [C1206]
C707  10pF  [C0603]
C708  10pF  [C0603]
C709  10pF  [C0603]
D700  ESD7104MUTAG  [UDFN10 2.5x1, 0.5P]
F700  NTHD4102PT1G  [NTHD4102PT1G]
F701  NTHD4102PT1G  [NTHD4102PT1G]
IC700  LTC4417CUF#PBF  [24QFN]
R700  5.1K  [R0402]
R701  22R  [R0402]
R702  22R  [R0402]
R703  5.1K  [R0402]
R704  453K  [R0402]
R705  453K  [R0402]
R706  453K  [R0402]
R707  0R/0402  [C0402]
R708  56K  [R0402]
R709  56K  [R0402]
R710  56K  [R0402]
R711  105K  [R0402]
R712  105K  [R0402]
R713  105K  [R0402]
USB700  TYPE_C  [2337857-1]

### Ports
NPOWER_IN_A (bidir), NPOWER_IN_B (bidir), NPOWER_IN_C (bidir), USB_D_N (bidir), USB_D_P (bidir)

### Nets
GND: C700.2 C701.2 C702.2 C703.1 C704.1 C705.1 C706.1 C707.1 C708.1 C709.1 D700.3(GND) D700.8(GND) R700.2 R703.2 R711.1 R712.1 R713.1 USB700.A1(GND) USB700.A12(GND) USB700.B1(GND) USB700.B12(GND) USB700.SH1(SHIELD) USB700.SH2(SHIELD) USB700.SH3(SHIELD) USB700.SH4(SHIELD) USB700.SH5(SHIELD) USB700.SH6(SHIELD)
VBUS: C703.2 D700.5(I/O) D700.6(NC) F701.7(D1) F701.8(D1) IC700.19(V3) R706.2 USB700.A4(VBUS) USB700.A9(VBUS) USB700.B4(VBUS) USB700.B9(VBUS)
VDD_5V_BRICK1: C700.1 C701.1 F700.7(D1) F700.8(D1) IC700.21(V1) R704.2
VDD_5V_IN: C705.2 C706.2 F700.5(D2) F700.6(D2) F701.5(D2) F701.6(D2) IC700.12(VOUT)
NetC702_1: C702.1 F701.1(S1) F701.3(S2) IC700.14(VS3)
NetC704_2: C704.2 F700.1(S1) F700.3(S2) IC700.18(VS1)
NetC707_2: C707.2 IC700.1(UV1) R704.1 R708.2
NetC708_2: C708.2 IC700.3(UV2) R705.1 R709.2
NetC709_2: C709.2 IC700.5(UV3) R706.1 R710.2
NetD700_1: D700.1(I/O) USB700.A6(DP1) USB700.B6(DP2)
NetD700_2: D700.2(I/O) USB700.A7(DN1) USB700.B7(DN2)
NetD700_9: D700.9(NC) R701.1
NetD700_10: D700.10(NC) R702.1
NetF700_2: F700.2(G1) F700.4(G2) IC700.17(G1)
NetF701_2: F701.2(G1) F701.4(G2) IC700.13(G3)
NetIC700_2: IC700.2(OV1) R708.1 R711.2
NetIC700_4: IC700.4(OV2) R709.1 R712.2
NetIC700_6: IC700.6(OV3) R710.1 R713.2
NetIC700_7: IC700.7(~{VALID1}) ; port NPOWER_IN_A
NetIC700_8: IC700.8(~{VALID2}) ; port NPOWER_IN_B
NetIC700_9: IC700.9(~{VALID3}) ; port NPOWER_IN_C
NetIC700_10: IC700.10(GND) IC700.25(EXP) R707.1
NetIC700_20: IC700.20(V2) R705.2
NetIC700_24: IC700.24(HYS) R707.2
NetR700_1: R700.1 USB700.A5(CC1)
NetR701_2: R701.2 ; port USB_D_N
NetR702_2: R702.2 ; port USB_D_P
NetR703_1: R703.1 USB700.B5(CC2)

Not connected (* = marked no-connect by the designer): D700 4(I/O)* 7(NC)*; IC700 11(CAS)* 15(G2) 16(VS2) 22(EN)* 23(~{SHDN})*; USB700 A8(SBU1)* B8(SBU2)*

### Notes on the sheet
- POWER MUX
- (near R707) Priority: Brick1>Brick2>VBUS
  Over Voltage: 5.85V
  Under Voltage: 3.81V
  HYS: 30m

### Library data of the parts
C700 C701 C703 = GRM21BR61A476ME15L: 47 µF ±20% 10V Ceramic Capacitor X5R 0805 (2012 Metric)
C702 C704 = CC0603KRX7R8BB104: CAP CER 0.1UF 25V X7R 0603
C705 C706 = CC1206MKX5R5BB107: 100 µF ±20% 6.3V Ceramic Capacitor X5R 1206 (3216 Metric)
C707-C709 = CC0603JRNPO8BN100: 10 pF ±5% 25V Ceramic Capacitor C0G, NP0 0603 (1608 Metric)
D700 = ESD7104MUTAG: TVS DIODE 5VWM 10VC 10UDFN
F700 F701 = NTHD4102PT1G: MOSFET 2P-CH 20V 2.9A CHIPFET
IC700 = LTC4417CUF#PBF: IC OR CTRLR SRC SELECT 24QFN
R700 R703 = RC0402FR-135K1L: Thick Film Resistors - SMD 5.1kOhms 1/16W 0402 1%
R701 R702 = RC0402FR-0722RL: 22 Ohms ±1% 0.063W, 1/16W Chip Resistor 0402 (1005 Metric) Moisture Resistant Thick Film
R704-R706 = RC0402FR-07453KL: 453 kOhms ±1% 0.063W, 1/16W Chip Resistor 0402 (1005 Metric) Moisture Resistant Thick Film
R707 = CR0402AJ/-000GAS: 0 Ohms Jumper Chip Resistor 0402 (1005 Metric) Anti-Sulfur, Automotive AEC-Q200, Moisture Resistant Thick Film
R708-R710 = RC0402FR-1356KL: 56 kOhms ±1% 0.063W, 1/16W Chip Resistor 0402 (1005 Metric) Thick Film
R711-R713 = RC0402FR-07105KL: 105 kOhms ±1% 0.063W, 1/16W Chip Resistor 0402 (1005 Metric) Moisture Resistant Thick Film
USB700 = 2337857-1: VERTICAL USB TYPE-C REC

## Sheet Main_4.SchDoc
size 219 x 170 mm; SheetNumber: 7; SheetTotal: 12
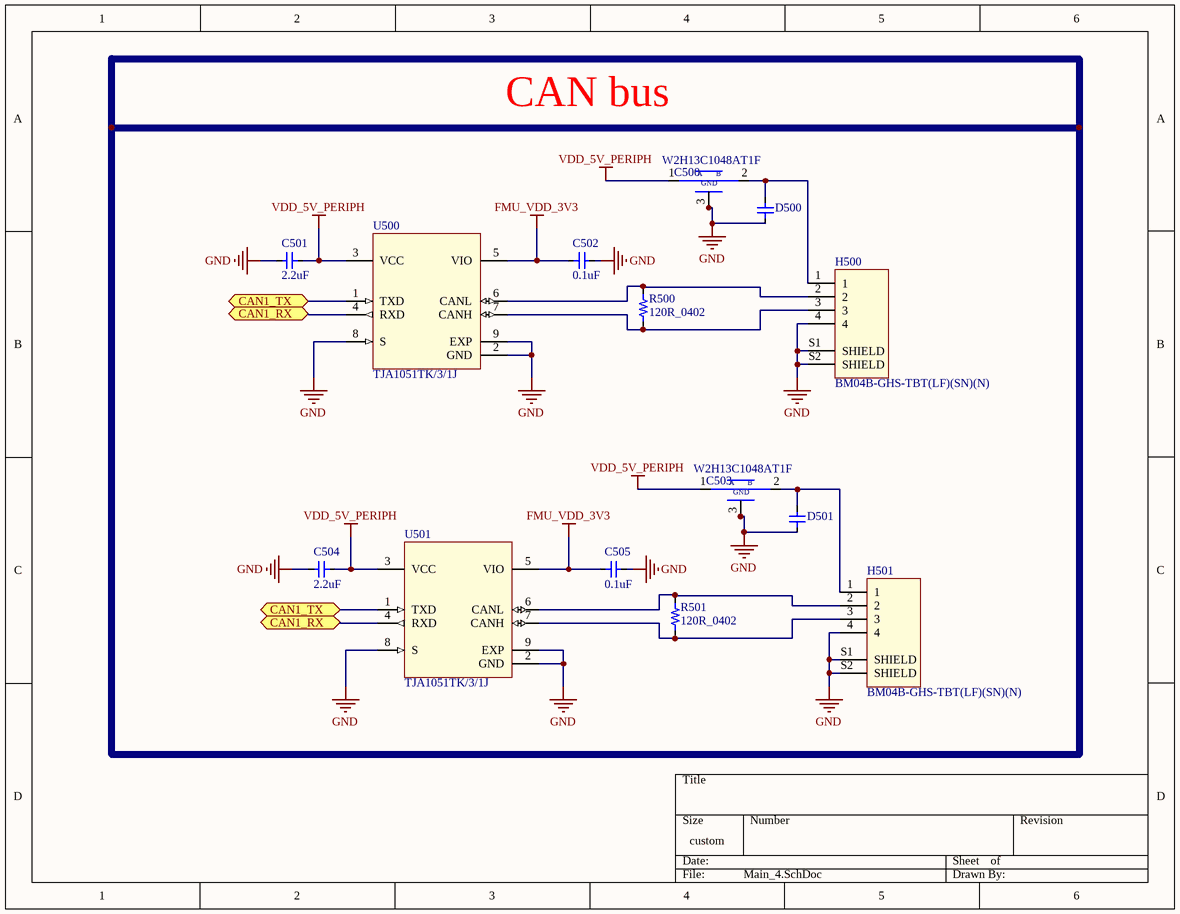
[diagram p5: Main_4.SchDoc]

### Parts
C500  W2H13C1048AT1F  [W2H13C1048AT1F]
C501  2.2uF  [C0603]
C502  0.1uF  [C0603]
C503  W2H13C1048AT1F  [W2H13C1048AT1F]
C504  2.2uF  [C0603]
C505  0.1uF  [C0603]
D500  PESD0402-140  [PESD0402-140]  (value not drawn)
D501  PESD0402-140  [PESD0402-140]  (value not drawn)
H500  BM04B-GHS-TBT(LF)(SN)(N)  [BM04B-GHS-TBT(LF)(SN)(N)]
H501  BM04B-GHS-TBT(LF)(SN)(N)  [BM04B-GHS-TBT(LF)(SN)(N)]
R500  120R_0402  [R0402]
R501  120R_0402  [R0402]
U500  TJA1051TK/3/1J  [8HVSON]
U501  TJA1051TK/3/1J  [8HVSON]

### Ports
CAN1_RX (bidir), CAN1_TX (bidir)

### Nets
FMU_VDD_3V3: C502.1 C505.1 U500.5(VIO) U501.5(VIO)
GND: C500.3 C500.4 C501.2 C502.2 C503.3 C503.4 C504.2 C505.2 D500.1 D501.1 H500.4 H500.S1(SHIELD) H500.S2(SHIELD) H501.4 H501.S1(SHIELD) H501.S2(SHIELD) U500.2(GND) U500.8(S) U500.9(EXP) U501.2(GND) U501.8(S) U501.9(EXP)
VDD_5V_PERIPH: C500.1 C501.1 C503.1 C504.1 U500.3(VCC) U501.3(VCC)
NetC500_2: C500.2 D500.2 H500.1
NetC503_2: C503.2 D501.2 H501.1
NetH500_2: H500.2 R500.2 U500.6(CANL)
NetH500_3: H500.3 R500.1 U500.7(CANH)
NetH501_2: H501.2 R501.2 U501.6(CANL)
NetH501_3: H501.3 R501.1 U501.7(CANH)
NetU500_1: U500.1(TXD) U501.1(TXD) ; port CAN1_TX
NetU500_4: U500.4(RXD) U501.4(RXD) ; port CAN1_RX

### Notes on the sheet
- CAN bus
- (in symbol W2H13C1048AT1F) A; B; GND

### Library data of the parts
C500 C503 = W2H13C1048AT1F: Feed Through Capacitors 25V 0.1uF X7R
C501 C504 = CC0603KPX5R6BB225: 2.2 µF ±10% 10V Ceramic Capacitor X5R 0603 (1608 Metric)
C502 C505 = CC0603KRX7R8BB104: CAP CER 0.1UF 25V X7R 0603
D500 D501 = PESD0402-140: 40V Clamp - Ipp Tvs Diode Surface Mount 0402
H500 H501 = BM04B-GHS-TBT(LF)(SN)(N): Connector Header Surface Mount 4 position 0.049" (1.25mm)
R500 R501 = RC0402FR-07120RL: 120 Ohms ±1% 0.063W, 1/16W Chip Resistor 0402 (1005 Metric) Moisture Resistant Thick Film
U500 U501 = TJA1051TK/3/1J: IC TRANSCEIVER HALF 1/1 8HVSON

## Sheet Main_2.SchDoc
size 379 x 180 mm; SheetNumber: 5; SheetTotal: 12
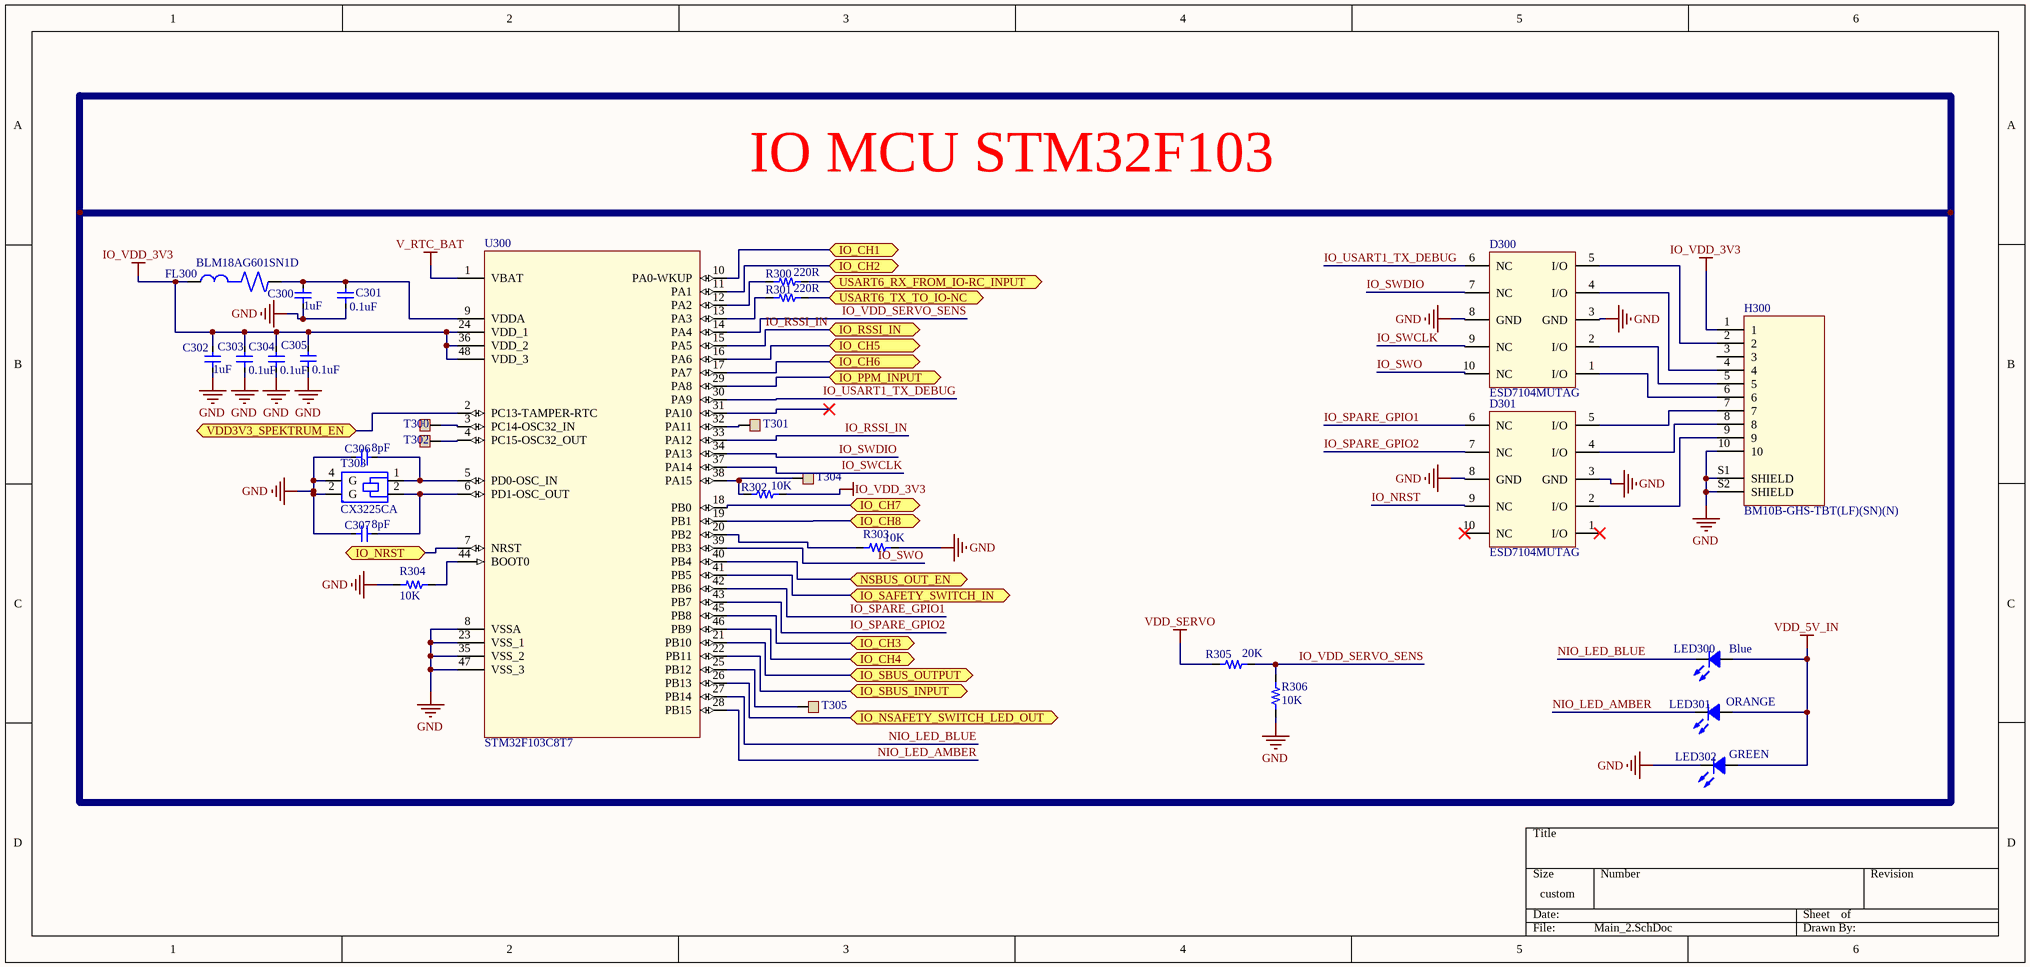
[diagram p6: Main_2.SchDoc]

### Parts
C300  1uF  [C0603]
C301  0.1uF  [C0603]
C302  1uF  [C0603]
C303  0.1uF  [C0603]
C304  0.1uF  [C0603]
C305  0.1uF  [C0603]
C306  8pF  [C0603]
C307  8pF  [C0603]
D300  ESD7104MUTAG  [UDFN10 2.5x1, 0.5P]
D301  ESD7104MUTAG  [UDFN10 2.5x1, 0.5P]
FL300  BLM18AG601SN1D  [BEADC1608X95N]
H300  BM10B-GHS-TBT(LF)(SN)(N)  [BM10B-GHS-TBT(LF)(SN)(N)]
LED300  Blue  [LED_0603_BLUE]
LED301  ORANGE  [LED_ORANGE_0603]
LED302  GREEN  [LED_GREEN_0603]
R300  220R  [R0402]
R301  220R  [R0402]
R302  10K  [R0402]
R303  10K  [R0402]
R304  10K  [R0402]
R305  20K  [R0402]
R306  10K  [R0402]
T300  TP  [TP_1.2]  (value not drawn)
T301  TP  [TP_1.2]  (value not drawn)
T302  TP  [TP_1.2]  (value not drawn)
T303  CX3225CA  [CX3225CA24000D0HSSCC]
T304  TP  [TP_1.2]  (value not drawn)
T305  TP  [TP_1.2]  (value not drawn)
U300  STM32F103C8T7  [48-LQFP]

### Ports
IO_CH1 (bidir), IO_CH2 (bidir), IO_CH3 (bidir), IO_CH4 (bidir), IO_CH5 (bidir), IO_CH6 (bidir), IO_CH7 (bidir), IO_CH8 (bidir), IO_NRST (bidir), IO_NSAFETY_SWITCH_LED_OUT (bidir), IO_PPM_INPUT (bidir), IO_RSSI_IN (bidir), IO_SAFETY_SWITCH_IN (bidir), IO_SBUS_INPUT (bidir), IO_SBUS_OUTPUT (bidir), NSBUS_OUT_EN (bidir), USART6_RX_FROM_IO-RC_INPUT (bidir), USART6_TX_TO_IO-NC (bidir), VDD3V3_SPEKTRUM_EN (bidir)

### Nets
GND: C300.1 C301.1 C302.1 C303.1 C304.1 C305.1 C306.1 C307.1 D300.3(GND) D300.8(GND) D301.3(GND) D301.8(GND) H300.10 H300.S1(SHIELD) H300.S2(SHIELD) LED302.2 R303.2 R304.1 R306.1 T303.2(G) T303.4(G) U300.8(VSSA) U300.23(VSS_1) U300.35(VSS_2) U300.47(VSS_3)
IO_VDD_3V3: C302.2 C303.2 C304.2 C305.2 FL300.1 H300.1 R302.2 U300.24(VDD_1) U300.36(VDD_2) U300.48(VDD_3)
V_RTC_BAT: U300.1(VBAT)
VDD_5V_IN: LED300.1 LED301.1 LED302.1
VDD_SERVO: R305.1
IO_NRST: D301.9(NC)
IO_RSSI_IN: U300.15(PA5) U300.33(PA12) ; port IO_RSSI_IN
IO_SPARE_GPIO1: D301.6(NC) U300.42(PB6)
IO_SPARE_GPIO2: D301.7(NC) U300.43(PB7)
IO_SWCLK: D300.9(NC) U300.37(PA14)
IO_SWDIO: D300.7(NC) U300.34(PA13)
IO_SWO: D300.10(NC) U300.39(PB3)
IO_USART1_TX_DEBUG: D300.6(NC) U300.30(PA9)
IO_VDD_SERVO_SENS: R305.2 R306.2 U300.14(PA4)
NIO_LED_AMBER: LED301.2 U300.28(PB15)
NIO_LED_BLUE: LED300.2 U300.27(PB14)
NetC300_2: C300.2 C301.2 FL300.2 U300.9(VDDA)
NetC306_2: C306.2 T303.1 U300.5(PD0-OSC_IN)
NetC307_2: C307.2 T303.2 U300.6(PD1-OSC_OUT)
NetC810_2: U300.7(NRST) ; port IO_NRST
NetD300_1: D300.1(I/O) H300.6
NetD300_2: D300.2(I/O) H300.5
NetD300_4: D300.4(I/O) H300.4
NetD300_5: D300.5(I/O) H300.2
NetD301_2: D301.2(I/O) H300.9
NetD301_4: D301.4(I/O) H300.8
NetD301_5: D301.5(I/O) H300.7
NetIC602_2: U300.2(PC13-TAMPER-RTC) ; port VDD3V3_SPEKTRUM_EN
NetIC603_5: U300.21(PB10) ; port IO_SBUS_OUTPUT
NetIC603_6: U300.22(PB11) ; port IO_SBUS_INPUT
NetR300_1: R300.1 U300.12(PA2)
NetR300_2: R300.2 ; port USART6_RX_FROM_IO-RC_INPUT
NetR301_1: R301.1 U300.13(PA3)
NetR301_2: R301.2 ; port USART6_TX_TO_IO-NC
NetR302_1: R302.1 T304.1 U300.38(PA15)
NetR303_1: R303.1 U300.20(PB2)
NetR304_2: R304.2 U300.44(BOOT0)
NetR409_1: U300.41(PB5) ; port IO_SAFETY_SWITCH_IN
NetR414_1: U300.26(PB13) ; port IO_NSAFETY_SWITCH_LED_OUT
NetR604_1: U300.29(PA8) ; port IO_PPM_INPUT
NetR608_2: U300.40(PB4) ; port NSBUS_OUT_EN
NetR908_1: U300.46(PB9) ; port IO_CH4
NetR909_1: U300.45(PB8) ; port IO_CH3
NetR910_1: U300.11(PA1) ; port IO_CH2
NetR911_1: U300.10(PA0-WKUP) ; port IO_CH1
NetR912_1: U300.19(PB1) ; port IO_CH8
NetR913_1: U300.18(PB0) ; port IO_CH7
NetR914_1: U300.17(PA7) ; port IO_CH6
NetR915_1: U300.16(PA6) ; port IO_CH5
NetT300_1: T300.1 U300.3(PC14-OSC32_IN)
NetT301_1: T301.1 U300.32(PA11)
NetT302_1: T302.1 U300.4(PC15-OSC32_OUT)
NetT305_1: T305.1 U300.25(PB12)

Not connected (* = marked no-connect by the designer): D301 1(I/O)* 10(NC)*; H300 3; U300 31(PA10)*

### Notes on the sheet
- IO MCU STM32F103

### Library data of the parts
C300 C302 = CC0603JRX7R6BB105: CAP CER 1UF 10V X7R 0603
C301 C303-C305 = CC0603KRX7R8BB104: CAP CER 0.1UF 25V X7R 0603
C306 C307 = CC0603DRNPO9BN8R0: 8 pF ±0.5pF 50V Ceramic Capacitor C0G, NP0 0603 (1608 Metric)
D300 D301 = ESD7104MUTAG: TVS DIODE 5VWM 10VC 10UDFN
FL300 = BLM18AG601SN1D: FERRITE BEAD 600 OHM 0603 1LN
H300 = BM10B-GHS-TBT(LF)(SN)(N): Connector Header Surface Mount 10 position 0.049" (1.25mm)
LED300 = LTST-C190TBKT: LED BLUE CLEAR CHIP SMD
LED301 = LTST-C190KFKT: Orange 605nm LED Indication - Discrete 2V 0603 (1608 Metric)
LED302 = LTST-C190GKT: Green 569nm LED Indication - Discrete 2.1V 0603 (1608 Metric)
R300 R301 = RC0402FR-07220RL: RES 220 OHM 1% 1/16W 0402
R302-R304 R306 = RC1005F103CS: RES SMD 10K OHM 1% 1/16W 0402
R305 = RC0402FR-0720KL: RES 20K OHM 1% 1/16W 0402
T300-T302 T304 T305 = Test point: 1.2mmx1.2mm
T303 = CX3225CA24000D0HSSCC: CRYSTAL 24.0000MHZ 8PF SMD
U300 = STM32F103C8T7: ARM® Cortex®-M3 STM32F1 Microcontroller IC 32-Bit Single-Core 72MHz 64KB (64K x 8) FLASH 48-LQFP (7x7)

## Sheet Main_7.SchDoc
size 400 x 200 mm; SheetNumber: 10; SheetTotal: 12
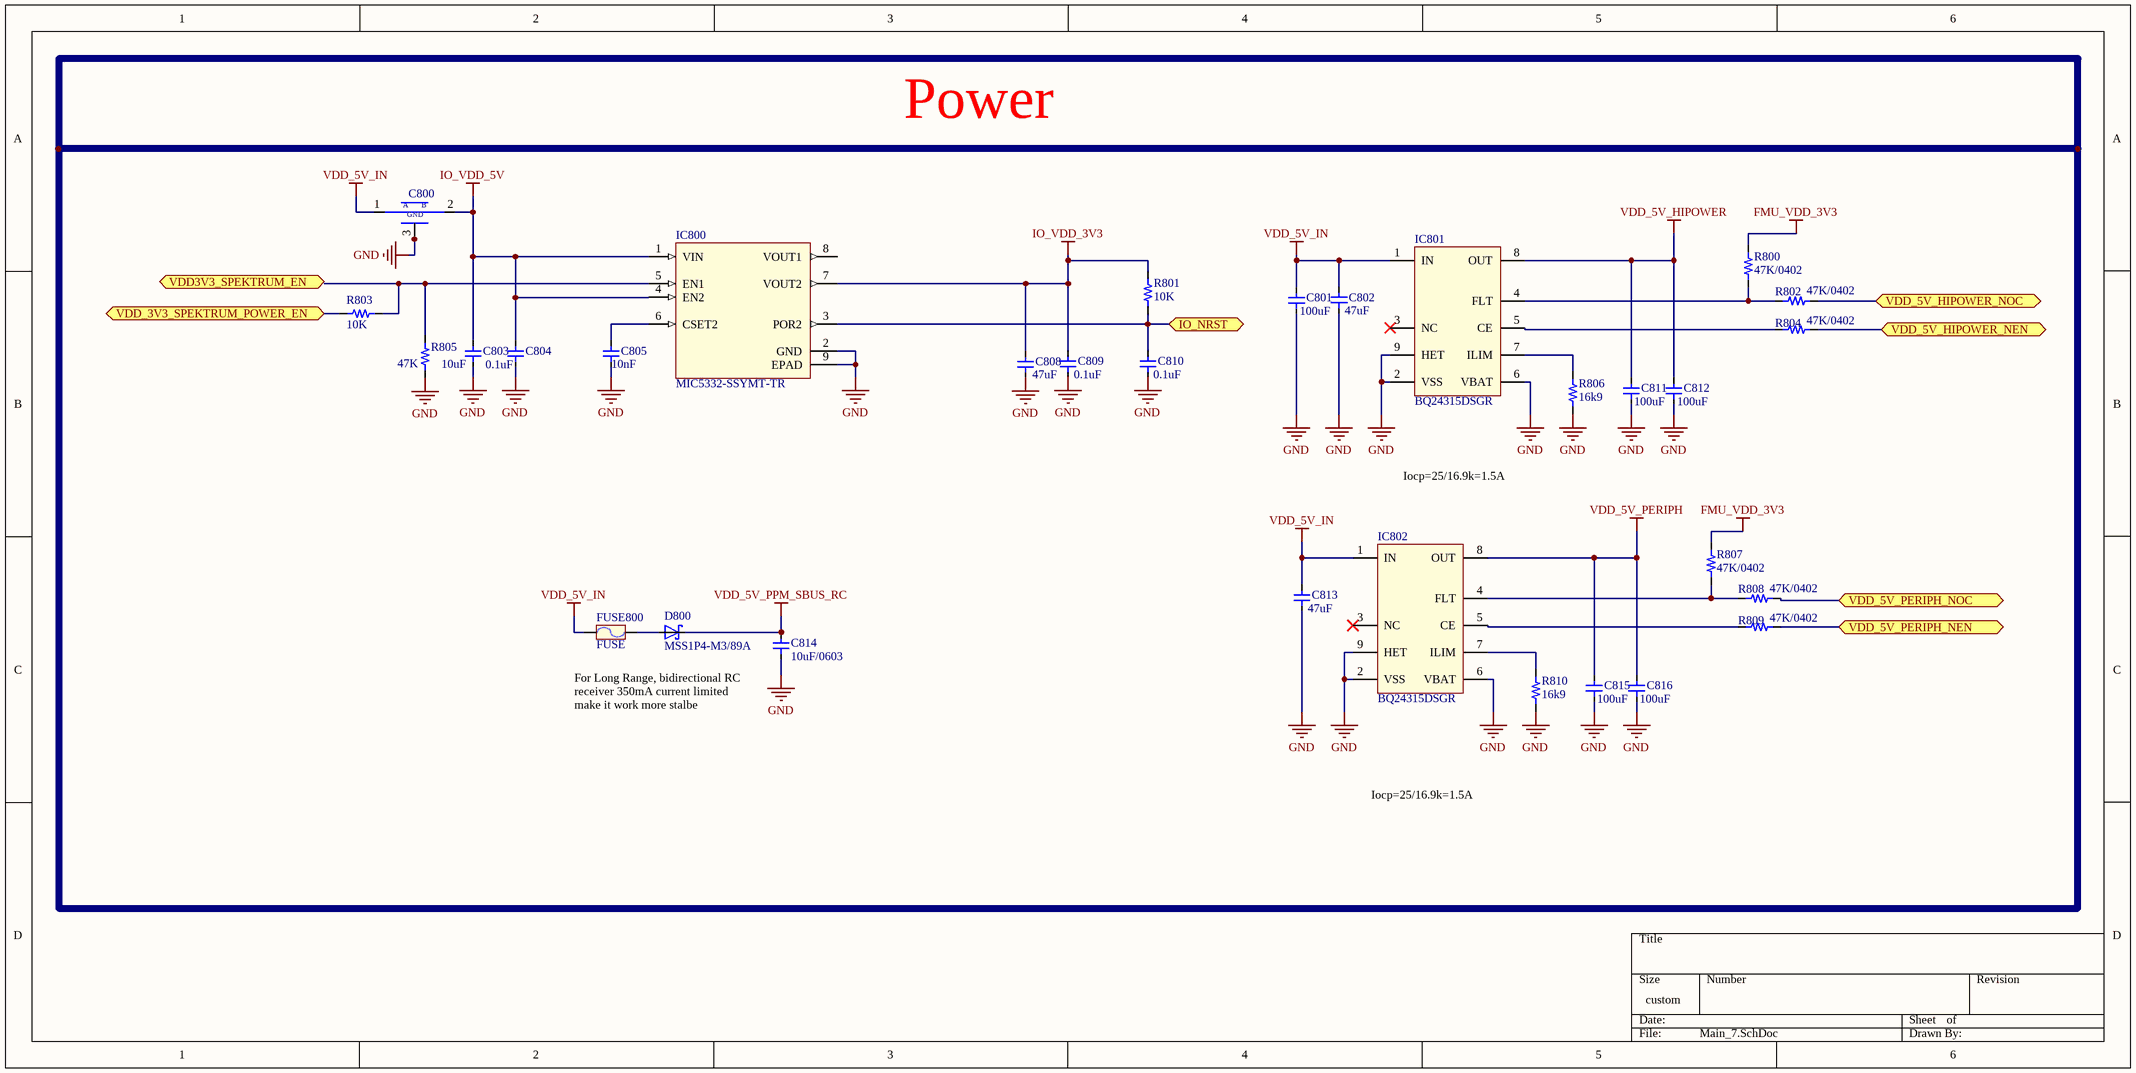
[diagram p7: Main_7.SchDoc]

### Parts
C800  W2H13C1048AT1F  [W2H13C1048AT1F]  (value not drawn)
C801  100uF  [C1206]
C802  47uF  [C0805]
C803  10uF  [C0603]
C804  0.1uF  [C0603]
C805  10nF  [C0603]
C808  47uF  [C0805]
C809  0.1uF  [C0603]
C810  0.1uF  [C0603]
C811  100uF  [C1206]
C812  100uF  [C1206]
C813  47uF  [C0805]
C814  10uF/0603  [C0603]
C815  100uF  [C1206]
C816  100uF  [C1206]
D800  MSS1P4-M3/89A  [MSS1P4-M3/89A]
FUSE800  FUSE  [FUSE_1206]
IC800  MIC5332-SSYMT-TR  [8-UFDFN]
IC801  BQ24315DSGR  [WSON-8]
IC802  BQ24315DSGR  [WSON-8]
R800  47K/0402  [R0402]
R801  10K  [R0402]
R802  47K/0402  [R0402]
R803  10K  [R0402]
R804  47K/0402  [R0402]
R805  47K  [R0402]
R806  16k9  [R0402]
R807  47K/0402  [R0402]
R808  47K/0402  [R0402]
R809  47K/0402  [R0402]
R810  16k9  [R0402]

### Ports
IO_NRST (bidir), VDD3V3_SPEKTRUM_EN (bidir), VDD_3V3_SPEKTRUM_POWER_EN (bidir), VDD_5V_HIPOWER_NEN (bidir), VDD_5V_HIPOWER_NOC (bidir), VDD_5V_PERIPH_NEN (bidir), VDD_5V_PERIPH_NOC (bidir)

### Nets
FMU_VDD_3V3: R800.1 R807.1
GND: C800.3 C800.4 C801.1 C802.1 C803.1 C804.1 C805.1 C808.1 C809.1 C810.1 C811.1 C812.1 C813.1 C814.1 C815.1 C816.1 IC800.2(GND) IC800.9(EPAD) IC801.2(VSS) IC801.6(VBAT) IC801.9(HET) IC802.2(VSS) IC802.6(VBAT) IC802.9(HET) R805.1 R806.1 R810.1
IO_VDD_3V3: C808.2 C809.2 IC800.7(VOUT2) R801.2
IO_VDD_5V: C800.2 C803.2 C804.2 IC800.1(VIN) IC800.4(EN2)
VDD_5V_HIPOWER: C811.2 C812.2 IC801.8(OUT)
VDD_5V_IN: C800.1 C801.2 C802.2 C813.2 FUSE800.1 IC801.1(IN) IC802.1(IN)
VDD_5V_PERIPH: C815.2 C816.2 IC802.8(OUT)
VDD_5V_PPM_SBUS_RC: C814.2 D800.1(C)
NetC805_2: C805.2 IC800.6(CSET2)
NetC810_2: C810.2 IC800.3(POR2) R801.1 ; port IO_NRST
NetD800_2: D800.2(A) FUSE800.2
NetIC800_5: IC800.5(EN1) R803.2 R805.2
NetIC801_4: IC801.4(FLT) R800.2 R802.1
NetIC801_5: IC801.5(CE) R804.1
NetIC801_7: IC801.7(ILIM) R806.2
NetIC802_4: IC802.4(FLT) R807.2 R808.1
NetIC802_5: IC802.5(CE) R809.1
NetIC802_7: IC802.7(ILIM) R810.2
NetR802_2: R802.2 ; port VDD_5V_HIPOWER_NOC
NetR803_1: R803.1 ; port VDD_3V3_SPEKTRUM_POWER_EN
NetR804_2: R804.2 ; port VDD_5V_HIPOWER_NEN
NetR808_2: R808.2 ; port VDD_5V_PERIPH_NOC
NetR809_2: R809.2 ; port VDD_5V_PERIPH_NEN

Not connected (* = marked no-connect by the designer): IC800 8(VOUT1); IC801 3(NC)*; IC802 3(NC)*

### Notes on the sheet
- Power
- Iocp=25/16.9k=1.5A
- For Long Range, bidirectional RC receiver 350mA current limited make it work more stalbe
- (in symbol W2H13C1048AT1F) A; B; GND

### Library data of the parts
C800 = W2H13C1048AT1F: Feed Through Capacitors 25V 0.1uF X7R
C801 C811 C812 C815 C816 = CC1206MKX5R5BB107: as C705 on sheet Main_6
C802 C808 C813 = GRM21BR61A476ME15L: as C700 on sheet Main_6
C803 C814 = CC0603KRX5R6BB106: as C121 on sheet Power 12V_5V
C804 C809 C810 = CC0603KRX7R8BB104: CAP CER 0.1UF 25V X7R 0603
C805 = CC0603JRX7R8BB103: 10000 pF ±5% 25V Ceramic Capacitor X7R 0603 (1608 Metric)
D800 = MSS1P4-M3/89A: Diode 40 V 1A Surface Mount DO-219AD (MicroSMP)
FUSE800 = NANOSMDC035F-2: Polymeric PTC Resettable Fuse 16V 350 mA Ih Surface Mount 1206 (3216 Metric), Concave
IC801 IC802 = BQ24315DSGR: Overvoltage & Overcurrent Protection IC & Li+ Charger Front-End Protection IC
R800 R802 R804 R805 R807-R809 = RC0402FR-0747KL: 47 kOhms ±1% 0.063W, 1/16W Chip Resistor 0402 (1005 Metric) Moisture Resistant Thick Film
R801 R803 = RC1005F103CS: RES SMD 10K OHM 1% 1/16W 0402
R806 R810 = RC0402FR-0716K9L: 16.9 kOhms ±1% 0.063W, 1/16W Chip Resistor 0402 (1005 Metric) Moisture Resistant Thick Film

## Sheet Current_Me.SchDoc
size 229 x 200 mm; SheetNumber: 2; SheetTotal: 12
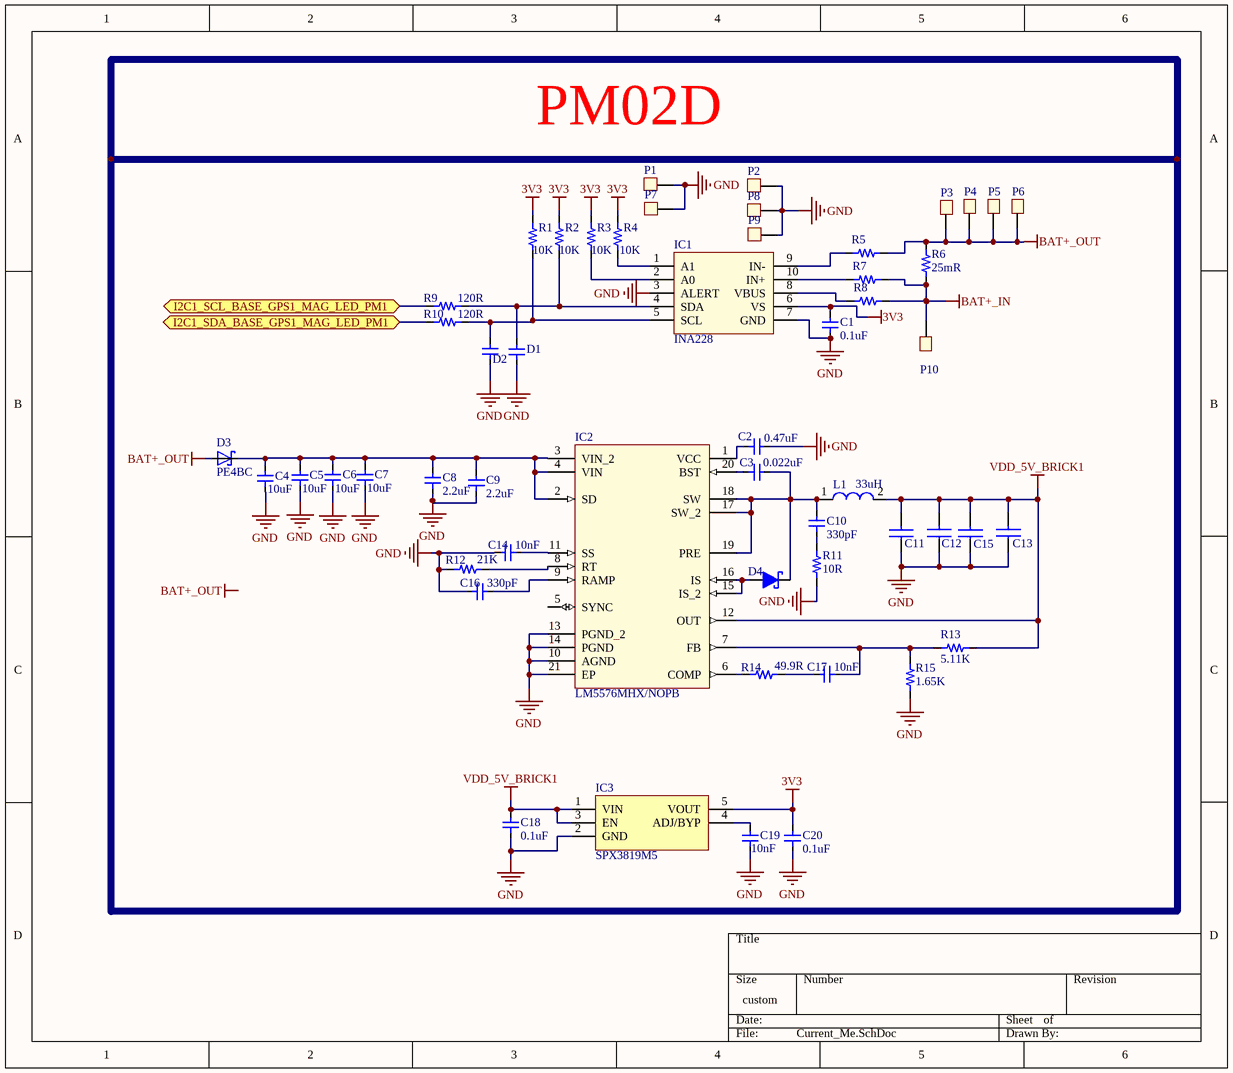
[diagram p8: Current_Me.SchDoc]

### Parts
C1  0.1uF  [C0603]
C2  0.47uF  [C0603]
C3  0.022uF  [C0603]
C4  10uF  [C1206]
C5  10uF  [C1206]
C6  10uF  [C1206]
C7  10uF  [C1206]
C8  2.2uF  [C0603]
C9  2.2uF  [C0603]
C10  330pF  [C0603]
C11  C2012X5R1A226M125AB  [C0805]  (value not drawn)
C12  C2012X5R1A226M125AB  [C0805]  (value not drawn)
C13  C2012X5R1A226M125AB  [C0805]  (value not drawn)
C14  10nF  [C0603]
C15  C2012X5R1A226M125AB  [C0805]  (value not drawn)
C16  330pF  [C0603]
C17  10nF  [C0603]
C18  0.1uF  [C0603]
C19  10nF  [C0603]
C20  0.1uF  [C0603]
D1  PESD0402-140  [PESD0402-140]  (value not drawn)
D2  PESD0402-140  [PESD0402-140]  (value not drawn)
D3  PE4BC  [PE4BC]
D4  MBRS3100T3G  [MBRS3100T3G]  (value not drawn)
IC1  INA228  [VSSOP10]
IC2  LM5576MHX/NOPB  [20HTSSOP]
IC3  SPX3819M5  [SOT23-5]
L1  33uH  [MGAH1005330M-10]
P1  PAD_hàn 5x5  [PAD 5x5]  (value not drawn)
P2  PAD_hàn 5x5  [PAD 5x5]  (value not drawn)
P3  PAD_hàn 5x5  [PAD 5x5]  (value not drawn)
P4  PAD_hàn 5x5  [PAD 5x5]  (value not drawn)
P5  PAD_hàn 5x5  [PAD 5x5]  (value not drawn)
P6  PAD_hàn 5x5  [PAD 5x5]  (value not drawn)
P7  PAD_hàn 5x5  [PAD 5x5]  (value not drawn)
P8  PAD_hàn 5x5  [PAD 5x5]  (value not drawn)
P9  PAD_hàn 5x5  [PAD 5x5]  (value not drawn)
P10  PAD_hàn 5x5  [PAD 5x5]  (value not drawn)
R1  10K  [R0402]
R2  10K  [R0402]
R3  10K  [R0402]
R4  10K  [R0402]
R5  0R/0402  [R0402]  (value not drawn)
R6  25mR  [R2818]
R7  0R/0402  [R0402]  (value not drawn)
R8  0R/0402  [R0402]  (value not drawn)
R9  120R  [R0402]
R10  120R  [R0402]
R11  10R  [R0603]
R12  21K  [R0402]
R13  5.11K  [R0402]
R14  49.9R  [R0402]
R15  1.65K  [R0402]

### Ports
I2C1_SCL_BASE_GPS1_MAG_LED_PM1 (bidir), I2C1_SDA_BASE_GPS1_MAG_LED_PM1 (bidir)

### Nets
3V3: C1.2 C20.2 IC1.6(VS) IC3.5(VOUT) R1.2 R2.2 R3.2 R4.2
BAT+_IN: P10.1 R6.1 R7.2 R8.2
BAT+_OUT: D3.2(A) P3.1 P4.1 P5.1 P6.1 R5.2 R6.2
GND: C1.1 C2.2 C4.1 C5.1 C6.1 C7.1 C8.1 C9.1 C11.1 C12.1 C13.1 C14.2 C15.1 C16.1 C18.1 C19.1 C20.1 D1.1 D2.1 IC1.3(ALERT) IC1.7(GND) IC2.10(AGND) IC2.13(PGND_2) IC2.14(PGND) IC2.21(EP) IC3.2(GND) P1.1 P2.1 P7.1 P8.1 P9.1 R11.1 R12.1 R15.1
VDD_5V_BRICK1: C11.2 C12.2 C13.2 C15.2 C18.2 IC2.12(OUT) IC3.1(VIN) IC3.3(EN) L1.2 R13.2
NetC2_1: C2.1 IC2.1(VCC)
NetC3_1: C3.1 IC2.20(BST)
NetC3_2: C3.2 C10.2 D4.2(K) IC2.17(SW_2) IC2.18(SW) IC2.19(PRE) L1.1
NetC4_2: C4.2 C5.2 C6.2 C7.2 C8.2 C9.2 D3.1(C) IC2.2(SD) IC2.3(VIN_2) IC2.4(VIN)
NetC10_1: C10.1 R11.2
NetC14_1: C14.1 IC2.11(SS)
NetC16_2: C16.2 IC2.9(RAMP)
NetC17_1: C17.1 IC2.7(FB) R13.1 R15.2
NetC17_2: C17.2 R14.2
NetC19_2: C19.2 IC3.4(ADJ/BYP)
NetD1_2: D1.2 IC1.4(SDA) R2.1 R9.2
NetD2_2: D2.2 IC1.5(SCL) R1.1 R10.2
NetD4_1: D4.1(A) IC2.15(IS_2) IC2.16(IS)
NetIC1_1: IC1.1(A1) R4.1
NetIC1_2: IC1.2(A0) R3.1
NetIC1_8: IC1.8(VBUS) R8.1
NetIC1_9: IC1.9(IN-) R5.1
NetIC1_10: IC1.10(IN+) R7.1
NetIC2_6: IC2.6(COMP) R14.1
NetIC2_8: IC2.8(RT) R12.2
NetR9_1: R9.1 ; port I2C1_SCL_BASE_GPS1_MAG_LED_PM1
NetR10_1: R10.1 ; port I2C1_SDA_BASE_GPS1_MAG_LED_PM1

Not connected (* = marked no-connect by the designer): IC2 5(SYNC)

### Notes on the sheet
- PM02D
- Labels drawn without touching a wire or pin: BAT+_OUT

### Library data of the parts
C1 C18 C20 = CC0603KRX7R8BB104: CAP CER 0.1UF 25V X7R 0603
C2 = CC0603KRX5R9BB474: as C127 on sheet Power 12V_5V
C3 = 0603B223K500CT: 0.022 µF ±10% 50V Ceramic Capacitor X7R 0603 (1608 Metric)
C4-C7 = C3216X6S2A106K160AC: as C122 on sheet Power 12V_5V
C8 C9 = CC0603KPX5R6BB225: as C501 on sheet Main_4
C10 C16 = CC0603KRX7R8BB331: 330 pF ±10% 25V Ceramic Capacitor X7R 0603 (1608 Metric)
C11-C13 C15 = C2012X5R1A226M125AB: Multilayer Ceramic Capacitors MLCC - SMD/SMT 0805 10V 22uF X5R 20% T: 1.25mm
C14 C17 C19 = CC0603JRX7R8BB103: as C805 on sheet Main_7
D1 D2 = PESD0402-140: as D500 on sheet Main_4
D3 = PE4BC: Diode 100 V 4A Surface Mount DO-214AB (SMC)
D4 = MBRS3100T3G: DIODE SCHOTTKY 100V 3A SMC
IC1 = INA228AQDGSRQ1: Current & Power Monitors & Regulators AEC-Q100 85-V 20-b it ultraprecise I
IC2 = LM5576MHX/NOPB: IC REG BUCK ADJ 3A 20HTSSOP
IC3 = SPX3819M5-L-3-0/TR: IC REG LINEAR 3V 500MA SOT23-5
L1 = MGAH1005330M-10: Power Inductors - SMD 33uH 0.075ohm 5A
R1-R4 = RC1005F103CS: RES SMD 10K OHM 1% 1/16W 0402
R5 R7 R8 = CR0402AJ/-000GAS: as R707 on sheet Main_6
R6 = WSHP2818R0250FEA: / 25 mOhms ±1% 10W Chip Resistor Nonstandard Automotive AEC-Q200, Current Sense, Moisture Resistant, Pulse Withstanding Metal Element
R9 R10 = RC0402FR-07120RL: as R500 on sheet Main_4
R11 = RMCF0603FT10R0: 10 Ohms ±1% 0.1W, 1/10W Chip Resistor 0603 (1608 Metric) Automotive AEC-Q200 Thick Film
R12 = RC0402FR-0721KL: / 21 kOhms ±1% 0.063W, 1/16W Chip Resistor 0402 (1005 Metric) Moisture Resistant Thick Film
R13 = ERJ-2RKF5111X: 5.11 kOhms ±1% 0.1W, 1/10W Chip Resistor 0402 (1005 Metric) Automotive AEC-Q200 Thick Film
R14 = CRT0402ABY-49R9GLF: 49.9 kOhms ±0.1% 0.063W, 1/16W Chip Resistor 0402 (1005 Metric) Anti-Sulfur, Automotive AEC-Q200 Thin Film
R15 = RC0402FR-071K65L: RES 1.65K OHM 1% 1/16W 0402

## Sheet Main_1.SchDoc
size 299 x 299 mm; SheetNumber: 4; SheetTotal: 12
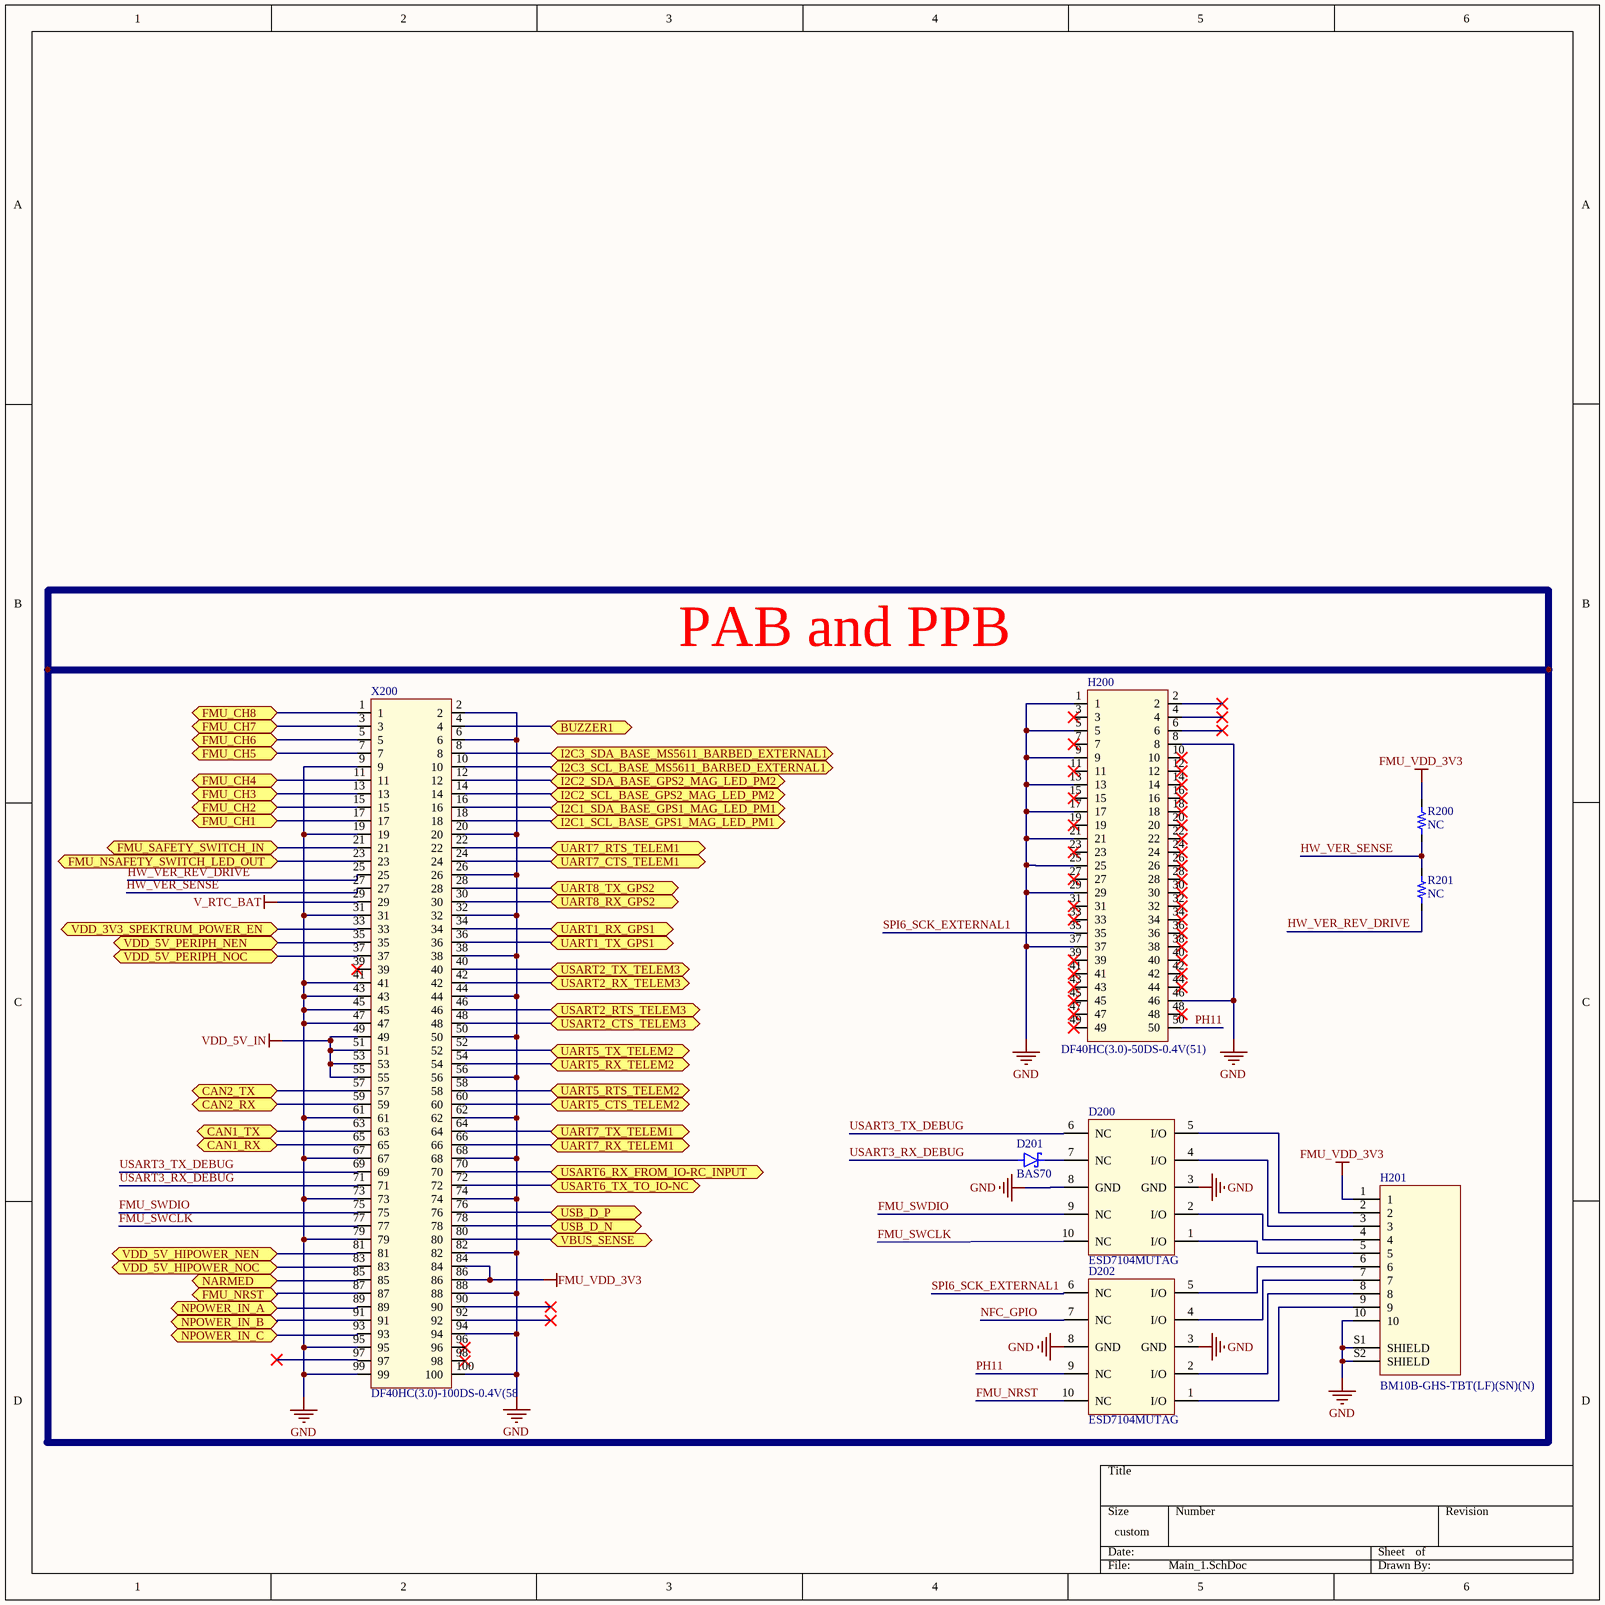
[diagram p9: Main_1.SchDoc]

### Parts
D200  ESD7104MUTAG  [UDFN10 2.5x1, 0.5P]
D201  BAS70  [SOT-23-3]
D202  ESD7104MUTAG  [UDFN10 2.5x1, 0.5P]
H200  DF40HC(3.0)-50DS-0.4V(51)  [DF40HC(4.0)-50DS-0.4V(51)]
H201  BM10B-GHS-TBT(LF)(SN)(N)  [BM10B-GHS-TBT(LF)(SN)(N)]
R200  NC  [R0603]
R201  NC  [R0603]
X200  DF40HC(3.0)-100DS-0.4V(58  [DF40HC(3.0)-100DS-0.4V(58]

### Ports
BUZZER1 (bidir), CAN1_RX (bidir), CAN1_TX (bidir), CAN2_RX (bidir), CAN2_TX (bidir), FMU_CH1 (bidir), FMU_CH2 (bidir), FMU_CH3 (bidir), FMU_CH4 (bidir), FMU_CH5 (bidir), FMU_CH6 (bidir), FMU_CH7 (bidir), FMU_CH8 (bidir), FMU_NRST (bidir), FMU_NSAFETY_SWITCH_LED_OUT (bidir), FMU_SAFETY_SWITCH_IN (bidir), I2C1_SCL_BASE_GPS1_MAG_LED_PM1 (bidir), I2C1_SDA_BASE_GPS1_MAG_LED_PM1 (bidir), I2C2_SCL_BASE_GPS2_MAG_LED_PM2 (bidir), I2C2_SDA_BASE_GPS2_MAG_LED_PM2 (bidir), I2C3_SCL_BASE_MS5611_BARBED_EXTERNAL1 (bidir), I2C3_SDA_BASE_MS5611_BARBED_EXTERNAL1 (bidir), NARMED (bidir), NPOWER_IN_A (bidir), NPOWER_IN_B (bidir), NPOWER_IN_C (bidir), UART1_RX_GPS1 (bidir), UART1_TX_GPS1 (bidir), UART5_CTS_TELEM2 (bidir), UART5_RTS_TELEM2 (bidir), UART5_RX_TELEM2 (bidir), UART5_TX_TELEM2 (bidir), UART7_CTS_TELEM1 (bidir), UART7_RTS_TELEM1 (bidir), UART7_RX_TELEM1 (bidir), UART7_TX_TELEM1 (bidir), UART8_RX_GPS2 (bidir), UART8_TX_GPS2 (bidir), USART2_CTS_TELEM3 (bidir), USART2_RTS_TELEM3 (bidir), USART2_RX_TELEM3 (bidir), USART2_TX_TELEM3 (bidir), USART6_RX_FROM_IO-RC_INPUT (bidir), USART6_TX_TO_IO-NC (bidir), USB_D_N (bidir), USB_D_P (bidir), VBUS_SENSE (bidir), VDD_3V3_SPEKTRUM_POWER_EN (bidir), VDD_5V_HIPOWER_NEN (bidir), VDD_5V_HIPOWER_NOC (bidir), VDD_5V_PERIPH_NEN (bidir), VDD_5V_PERIPH_NOC (bidir)

### Nets
FMU_VDD_3V3: H201.1 R200.2 X200.84 X200.86
GND: D200.3(GND) D200.8(GND) D202.3(GND) D202.8(GND) H200.1 H200.5 H200.8 H200.9 H200.13 H200.17 H200.21 H200.25 H200.29 H200.37 H200.46 H201.10 H201.S1(SHIELD) H201.S2(SHIELD) X200.2 X200.6 X200.9 X200.19 X200.20 X200.26 X200.31 X200.32 X200.38 X200.41 X200.43 X200.44 X200.45 X200.47 X200.50 X200.56 X200.61 X200.62 X200.67 X200.68 X200.73 X200.74 X200.79 X200.82 X200.88 X200.94 X200.95 X200.99 X200.100
V_RTC_BAT: X200.29
VDD_5V_IN: X200.49 X200.51 X200.53 X200.55
FMU_NRST: D202.10(NC)
FMU_SWCLK: D200.10(NC) X200.77
FMU_SWDIO: D200.9(NC) X200.75
HW_VER_REV_DRIVE: R201.1 X200.25
HW_VER_SENSE: R200.1 R201.2 X200.27
NFC_GPIO: D202.7(NC)
PH11: D202.9(NC) H200.50
SPI6_SCK_EXTERNAL1: D202.6(NC) H200.35
USART3_RX_DEBUG: D201.1(A) X200.71
USART3_TX_DEBUG: D200.6(NC) X200.69
NetD200_1: D200.1(I/O) H201.5
NetD200_2: D200.2(I/O) H201.4
NetD200_4: D200.4(I/O) H201.3
NetD200_5: D200.5(I/O) H201.2
NetD200_7: D200.7(NC) D201.3(C)
NetD202_1: D202.1(I/O) H201.9
NetD202_2: D202.2(I/O) H201.8
NetD202_4: D202.4(I/O) H201.7
NetD202_5: D202.5(I/O) H201.6
NetF400_1: X200.4 ; port BUZZER1
NetIC601_4: X200.80 ; port VBUS_SENSE
NetIC602_1: X200.85 ; port NARMED
NetIC602_4: X200.87 ; port FMU_NRST
NetIC700_7: X200.89 ; port NPOWER_IN_A
NetIC700_8: X200.91 ; port NPOWER_IN_B
NetIC700_9: X200.93 ; port NPOWER_IN_C
NetIC1000_5: X200.8 ; port I2C3_SDA_BASE_MS5611_BARBED_EXTERNAL1
NetIC1000_6: X200.10 ; port I2C3_SCL_BASE_MS5611_BARBED_EXTERNAL1
NetR9_1: X200.16 ; port I2C1_SDA_BASE_GPS1_MAG_LED_PM1
NetR10_1: X200.18 ; port I2C1_SCL_BASE_GPS1_MAG_LED_PM1
NetR300_2: X200.70 ; port USART6_RX_FROM_IO-RC_INPUT
NetR301_2: X200.72 ; port USART6_TX_TO_IO-NC
NetR400_1: X200.66 ; port UART7_RX_TELEM1
NetR401_1: X200.64 ; port UART7_TX_TELEM1
NetR402_1: X200.24 ; port UART7_CTS_TELEM1
NetR403_1: X200.22 ; port UART7_RTS_TELEM1
NetR404_1: X200.36 ; port UART1_TX_GPS1
NetR405_1: X200.34 ; port UART1_RX_GPS1
NetR408_1: X200.52 ; port UART5_TX_TELEM2
NetR410_1: X200.54 ; port UART5_RX_TELEM2
NetR411_1: X200.21 ; port FMU_SAFETY_SWITCH_IN
NetR412_1: X200.23 ; port FMU_NSAFETY_SWITCH_LED_OUT
NetR413_1: X200.58 ; port UART5_RTS_TELEM2
NetR415_1: X200.60 ; port UART5_CTS_TELEM2
NetR418_1: X200.40 ; port USART2_TX_TELEM3
NetR419_1: X200.42 ; port USART2_RX_TELEM3
NetR420_1: X200.48 ; port USART2_CTS_TELEM3
NetR421_1: X200.46 ; port USART2_RTS_TELEM3
NetR422_1: X200.28 ; port UART8_TX_GPS2
NetR423_1: X200.30 ; port UART8_RX_GPS2
NetR424_1: X200.14 ; port I2C2_SCL_BASE_GPS2_MAG_LED_PM2
NetR425_1: X200.12 ; port I2C2_SDA_BASE_GPS2_MAG_LED_PM2
NetR701_2: X200.78 ; port USB_D_N
NetR702_2: X200.76 ; port USB_D_P
NetR802_2: X200.83 ; port VDD_5V_HIPOWER_NOC
NetR803_1: X200.33 ; port VDD_3V3_SPEKTRUM_POWER_EN
NetR804_2: X200.81 ; port VDD_5V_HIPOWER_NEN
NetR808_2: X200.37 ; port VDD_5V_PERIPH_NOC
NetR809_2: X200.35 ; port VDD_5V_PERIPH_NEN
NetR900_1: X200.1 ; port FMU_CH8
NetR901_1: X200.3 ; port FMU_CH7
NetR902_1: X200.5 ; port FMU_CH6
NetR903_1: X200.7 ; port FMU_CH5
NetR904_1: X200.11 ; port FMU_CH4
NetR905_1: X200.13 ; port FMU_CH3
NetR906_1: X200.15 ; port FMU_CH2
NetR907_1: X200.17 ; port FMU_CH1
NetU500_1: X200.57 X200.63 ; port CAN2_TX, port CAN1_TX
NetU500_4: X200.59 X200.65 ; port CAN2_RX, port CAN1_RX

Not connected (* = marked no-connect by the designer): H200 2* 3* 4* 6* 7* 10* 11* 12* 14* 15* 16* 18* 19* 20* 22* 23* 24* 26* 27* 28* 30* 31* 32* 33* 34* 36* 38* 39* 40* 41* 42* 43* 44* 45* 47* 48* 49*; X200 39* 90* 92* 96* 97* 98*

### Notes on the sheet
- PAB and PPB

### Library data of the parts
D200 D202 = ESD7104MUTAG: TVS DIODE 5VWM 10VC 10UDFN
D201 = BAS70-04-7-F: Schottky Diodes & Rectifiers 70V 200mW
H200 = DF40HC(3.0)-50DS-0.4V(51): CONN RCPT 50POS SMD GOLD
H201 = BM10B-GHS-TBT(LF)(SN)(N): as H300 on sheet Main_2
R200 R201 = Resistor_NC
X200 = DF40HC(3.0)-100DS-0.4V(58: 100 Position Connector Receptacle, Center Strip Contacts Surface Mount Gold

## Sheet Main_9.SchDoc
size 170 x 170 mm; SheetNumber: 12; SheetTotal: 12
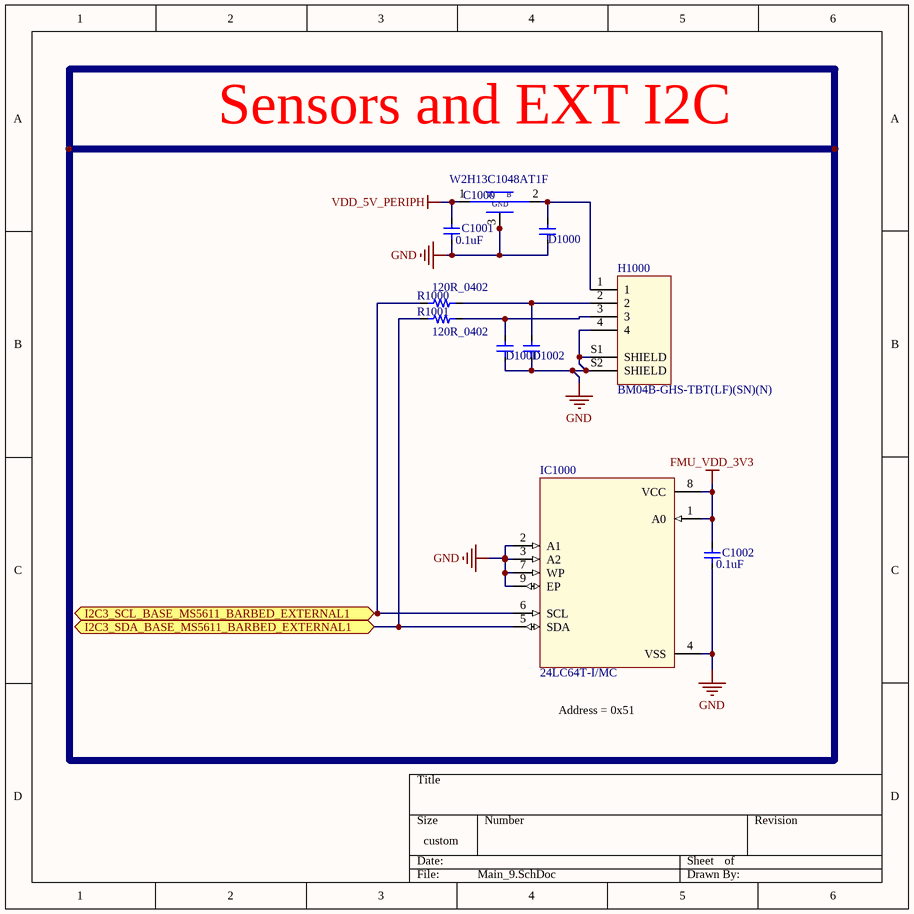
[diagram p10: Main_9.SchDoc]

### Parts
C1000  W2H13C1048AT1F  [W2H13C1048AT1F]
C1001  0.1uF  [C0603]
C1002  0.1uF  [C0603]
D1000  PESD0402-140  [PESD0402-140]  (value not drawn)
D1001  PESD0402-140  [PESD0402-140]  (value not drawn)
D1002  PESD0402-140  [PESD0402-140]  (value not drawn)
H1000  BM04B-GHS-TBT(LF)(SN)(N)  [BM04B-GHS-TBT(LF)(SN)(N)]
IC1000  24LC64T-I/MC  [8DFN]
R1000  120R_0402  [R0402]
R1001  120R_0402  [R0402]

### Ports
I2C3_SCL_BASE_MS5611_BARBED_EXTERNAL1 (bidir), I2C3_SDA_BASE_MS5611_BARBED_EXTERNAL1 (bidir)

### Nets
FMU_VDD_3V3: C1002.2 IC1000.1(A0) IC1000.8(VCC)
GND: C1000.3 C1000.4 C1001.1 C1002.1 D1000.1 D1001.1 D1002.1 H1000.4 H1000.S1(SHIELD) H1000.S2(SHIELD) IC1000.2(A1) IC1000.3(A2) IC1000.4(VSS) IC1000.7(WP) IC1000.9(EP)
VDD_5V_PERIPH: C1000.1 C1001.2
NetC1000_2: C1000.2 D1000.2 H1000.1
NetD1001_2: D1001.2 H1000.3 R1001.2
NetD1002_2: D1002.2 H1000.2 R1000.2
NetIC1000_5: IC1000.5(SDA) R1001.1 ; port I2C3_SDA_BASE_MS5611_BARBED_EXTERNAL1
NetIC1000_6: IC1000.6(SCL) R1000.1 ; port I2C3_SCL_BASE_MS5611_BARBED_EXTERNAL1

### Notes on the sheet
- Sensors and EXT I2C
- (near IC1000) Address = 0x51
- (in symbol W2H13C1048AT1F) A; B; GND

### Library data of the parts
C1000 = W2H13C1048AT1F: Feed Through Capacitors 25V 0.1uF X7R
C1001 C1002 = CC0603KRX7R8BB104: CAP CER 0.1UF 25V X7R 0603
D1000-D1002 = PESD0402-140: as D500 on sheet Main_4
H1000 = BM04B-GHS-TBT(LF)(SN)(N): as H500 on sheet Main_4
IC1000 = 24LC64T-I/MC: IC EEPROM 64KBIT I2C 400KHZ 8DFN
R1000 R1001 = RC0402FR-07120RL: as R500 on sheet Main_4